# Altium project SGK_DVR_01.PrjPcb (part 1 of 2)
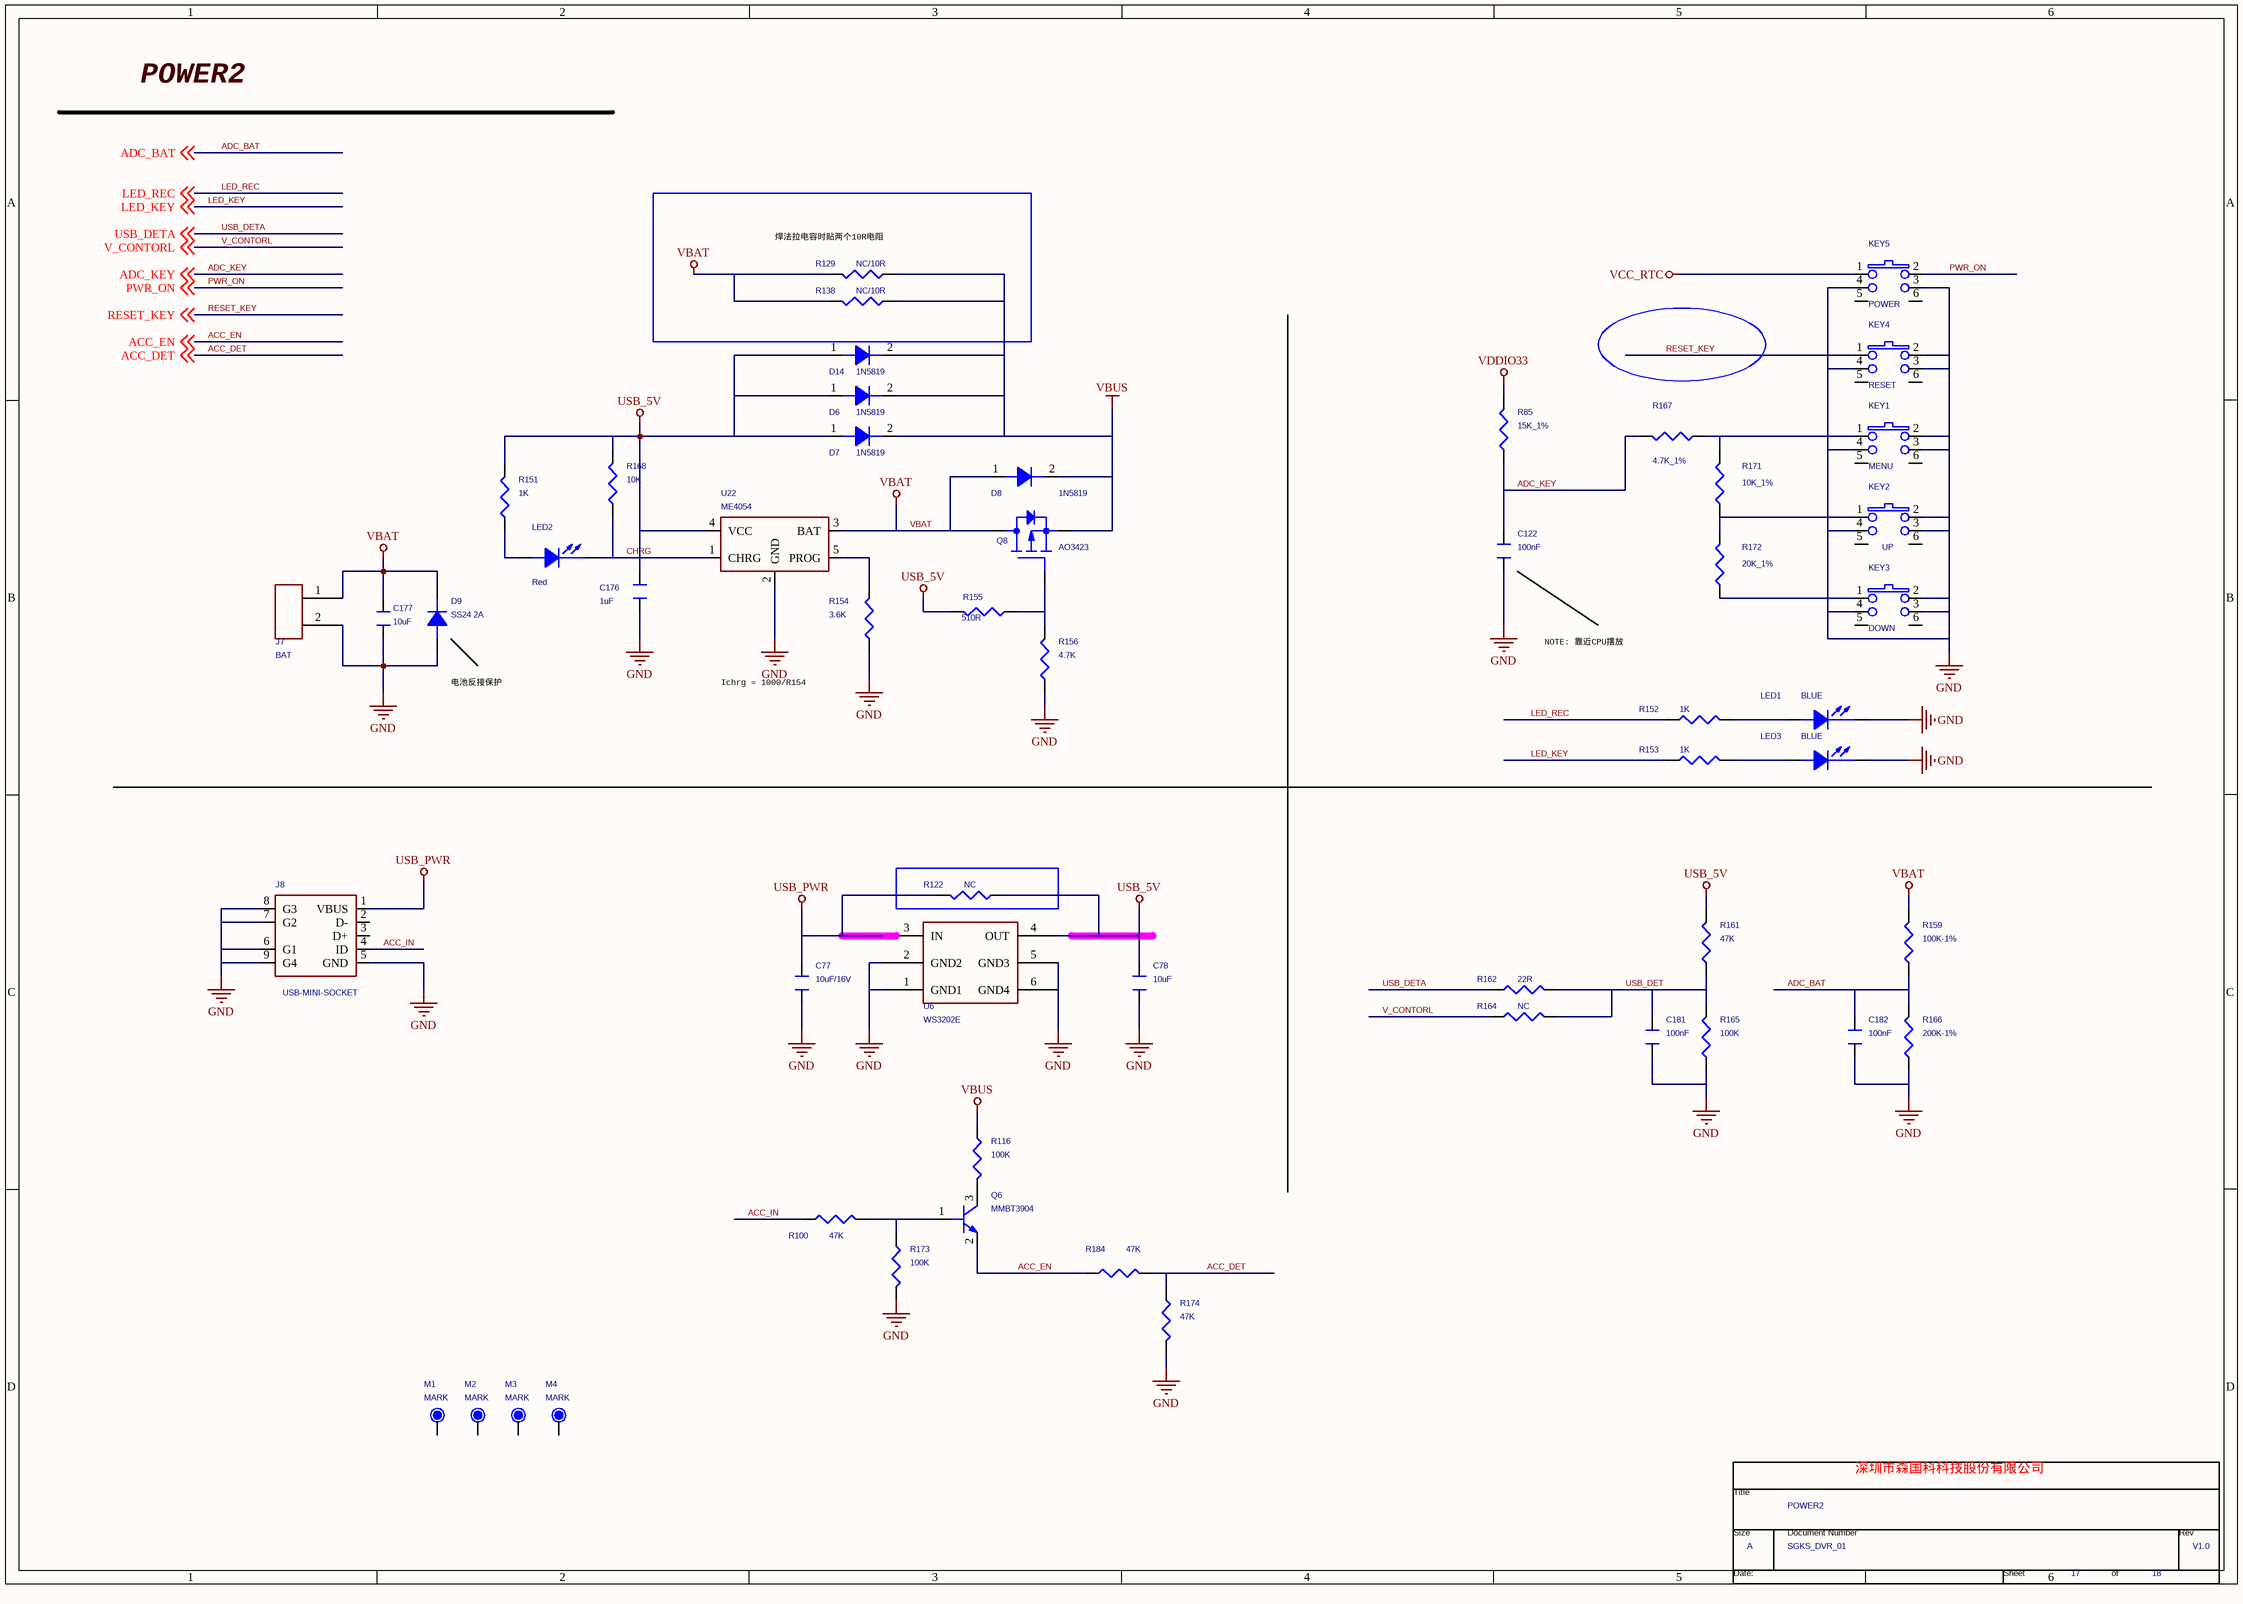
[diagram p0: P17 POWER2.SchDoc]
18 sheets, 493 parts. Net scope: global (net labels, ports and power ports of the same name join across sheets).
Board file: SGK_DVR_01.PcbDoc
Sheets:
  P17 POWER2.SchDoc
  P16 POWER1.SchDoc
  P15 AHD & USBCAM.SchDoc
  P14 FLASH & TF & GSENSO.SchDoc
  P13 MIC & AUDIO.SchDoc
  P12 MIPI LCD.SchDoc
  P11 CMOS SENSOR.SchDoc
  P10 PR2000K_MIPI.SchDoc
  P09 DDR3.SchDoc
  P08 CPU_4.SchDoc
  P07 CPU_3.SchDoc
  P06 CPU_2.SchDoc
  P05 CPU_1.SchDoc
  P04 Pin MAP.SchDoc
  P03 POWER TREE.SchDoc
  P02 Block.SchDoc
  P01 Version.SchDoc
  P18 GPS.SchDoc

## Sheet P17 POWER2.SchDoc
size 420 x 297 mm

### Parts
(Parts that share a designator on the sheet are numbered #1, #2 ... from top to bottom, then left to right.)
*#1  Page Count: 18  Page Number: 17  Page Size: A  Title: POWER2  RevCode: V1.0  Doc: SGKS_DVR_01  (hidden comment: TitleBlock0)  (graphical)
C77  10uF/16V  [C0805]
C78  10uF  [C0805]
C122  100nF  [C0402]
C176  1uF  [C0402]
C177  10uF  [C0603]
C181  100nF  [C0402]
C182  100nF  [C0402]
D6  1N5819  [SOD-123]
D7  1N5819  [SOD-123]
D8  1N5819  [SOD-123]
D9  SS24 2A  [SOD-123]
D14  1N5819  [SOD-123]
J7  BAT  [CON2P254]
J8  USB-MINI-SOCKET  [USB_MINI_AB]
KEY1  MENU  [button]
KEY2  UP  [button]
KEY3  DOWN  [button]
KEY4  RESET  [button]
KEY5  POWER  [button]
LED1  BLUE  [LED-0603]
LED2  Red  [LED-0603]
LED3  BLUE  [LED-0603]
M1  MARK  [TP/SMD/D1.0]
M2  MARK  [TP/SMD/D1.0]
M3  MARK  [TP/SMD/D1.0]
M4  MARK  [TP/SMD/D1.0]
Q6  MMBT3904  [SOT-23]
Q8  AO3423  [SOT-23]
R85  15K_1%  [R0402]
R100  47K  [R0603/SMD]
R116  100K  [R0603/SMD]
R122  NC  [R0603]
R129  NC/10R  [R0603]
R138  NC/10R  [R0603]
R151  1K  [R0402]
R152  1K  [R0603/SMD]
R153  1K  [R0603/SMD]
R154  3.6K  [R0402]
R155  510R  [R0402]
R156  4.7K  [R0402]
R159  100K-1%  [R0402]
R161  47K  [R0402]
R162  22R  [R0603/SMD]
R164  NC  [R0603/SMD]
R165  100K  [R0402]
R166  200K-1%  [R0402]
R167  4.7K_1%  [R0603/SMD]
R168  10K  [R0402]
R171  10K_1%  [R0603/SMD]
R172  20K_1%  [R0603/SMD]
R173  100K  [R0603/SMD]
R174  47K  [R0603/SMD]
R184  47K  [R0603/SMD]
U6  WS3202E  [SOT23-6]
U22  ME4054  [SOT23-6]

### Blocks framed on the sheet
焊法拉电容时贴两个10R电阻: R129 R138

### Nets
GND: C77.1 C78.1 C122.1 C176.1 C177.1 C181.1 C182.1 D9.1(A) J7.2 J8.5(GND) J8.6(G1) J8.7(G2) J8.8(G3) J8.9(G4) KEY1.2 KEY1.3 KEY1.4 KEY2.2 KEY2.3 KEY2.4 KEY3.2 KEY3.3 KEY3.4 KEY4.2 KEY4.3 KEY4.4 KEY5.3 KEY5.4 LED1.2(CATHODE) LED3.2(CATHODE) R154.1 R156.1 R165.2 R166.2 R173.2 R174.2 U6.1(GND1) U6.2(GND2) U6.5(GND3) U6.6(GND4) U22.2(GND)
USB_5V: C78.2 C176.2 D6.1(A) D7.1(A) D14.1(A) R122.1 R151.2 R155.2 R161.1 R168.2 U6.4(OUT) U22.4(VCC)
USB_PWR: C77.2 J8.1(VBUS) R122.2 U6.3(IN)
VBAT: C177.2 D8.1(A) D9.2(K) J7.1 Q8.3(DRAIN) R129.2 R138.2 R159.1 U22.3(BAT)
VBUS: D6.2(K) D7.2(K) D8.2(K) D14.2(K) Q8.2(SOURCE) R116.1 R129.1 R138.1
VCC_RTC: KEY5.1
VDDIO33: R85.1  [project net AVDD33]
ACC_DET: R174.1 R184.2 ; off-sheet ACC_DET
ACC_EN: Q6.2(E) R184.1 ; off-sheet ACC_EN
ACC_IN: J8.4(ID) R100.1
ADC_BAT: C182.2 R159.2 R166.1 ; off-sheet ADC_BAT
ADC_KEY: C122.2 R85.2 R167.2 ; off-sheet ADC_KEY
CHRG: LED2.2(CATHODE) R168.1 U22.1(CHRG)
LED_KEY: R153.1 ; off-sheet LED_KEY
LED_REC: R152.1 ; off-sheet LED_REC
PWR_ON: KEY5.2 ; off-sheet PWR_ON
RESET_KEY: KEY4.1 ; off-sheet RESET_KEY
USB_DET: C181.2 R161.2 R162.2 R164.2 R165.1
USB_DETA: R162.1 ; off-sheet USB_DETA
V_CONTORL: R164.1 ; off-sheet V_CONTORL
NetKEY1_1: KEY1.1 R167.1 R171.2
NetKEY2_1: KEY2.1 R171.1 R172.2
NetKEY3_1: KEY3.1 R172.1
NetLED1_1: LED1.1(ANODE) R152.2
NetLED2_1: LED2.1(ANODE) R151.1
NetLED3_1: LED3.1(ANODE) R153.2
NetQ6_1: Q6.1(B) R100.2 R173.1
NetQ6_3: Q6.3(C) R116.2
NetQ8_1: Q8.1(GATE) R155.1 R156.2
NetR154_2: R154.2 U22.5(PROG)

Not connected (* = marked no-connect by the designer): J8 2(D-) 3(D+); KEY1 5 6; KEY2 5 6; KEY3 5 6; KEY4 5 6; KEY5 5 6; M1 1; M2 1; M3 1; M4 1

### Notes on the sheet
- POWER2
- NOTE: 靠近CPU摆放
- (near D9) 电池反接保护
- Ichrg = 1000/R154
- 深圳市森国科科技股份有限公司
- (in symbol TitleBlock0) Title; Size; Document Number; Rev; Date:; Sheet; of

### Library data of the parts
C77 C78 = CAPACITOR_0_Dup4: ROOM: PMU; PAGE: 1
C122 = CAPACITOR_0_Dup4: PAGE: 1; ROOM: PMU
C176 C177 C181 C182 = CAPACITOR: PAGE: 1
D6-D8 D14 = DIODE_0: 二极管
D9 = DIODE
J7 = CON3_0
J8 = USB_MINI_SOCKET_2
KEY1-KEY5 = button_1: Button; FPLIST: BUTTON,KEY; Part Number: Button; Part Type: 轻触按键
LED1-LED3 = LED
M1-M4 = TP_0: Part Description: Test Point; Type: NC
Q6 = NPN
Q8 = PMOS
R85 R159 R161 R165 R166 = RESISTOR_Dup2
R100 R116 R173 R174 R184 = RES/SMD_1: Part Description: Chip Resistor; Type: 贴片电阻
R122 R129 R138 R151 R154-R156 R168 = R_Dup1
R152 R153 R162 R164 R167 R171 R172 = RES/SMD_0: Part Description: Chip Resistor
U6 = AP3031_0: Page: 10
U22 = RT9266PE_0_Dup1
*#1 = TitleBlock0: Page Create Date: March  8, 1995

## Sheet P16 POWER1.SchDoc
size 420 x 297 mm
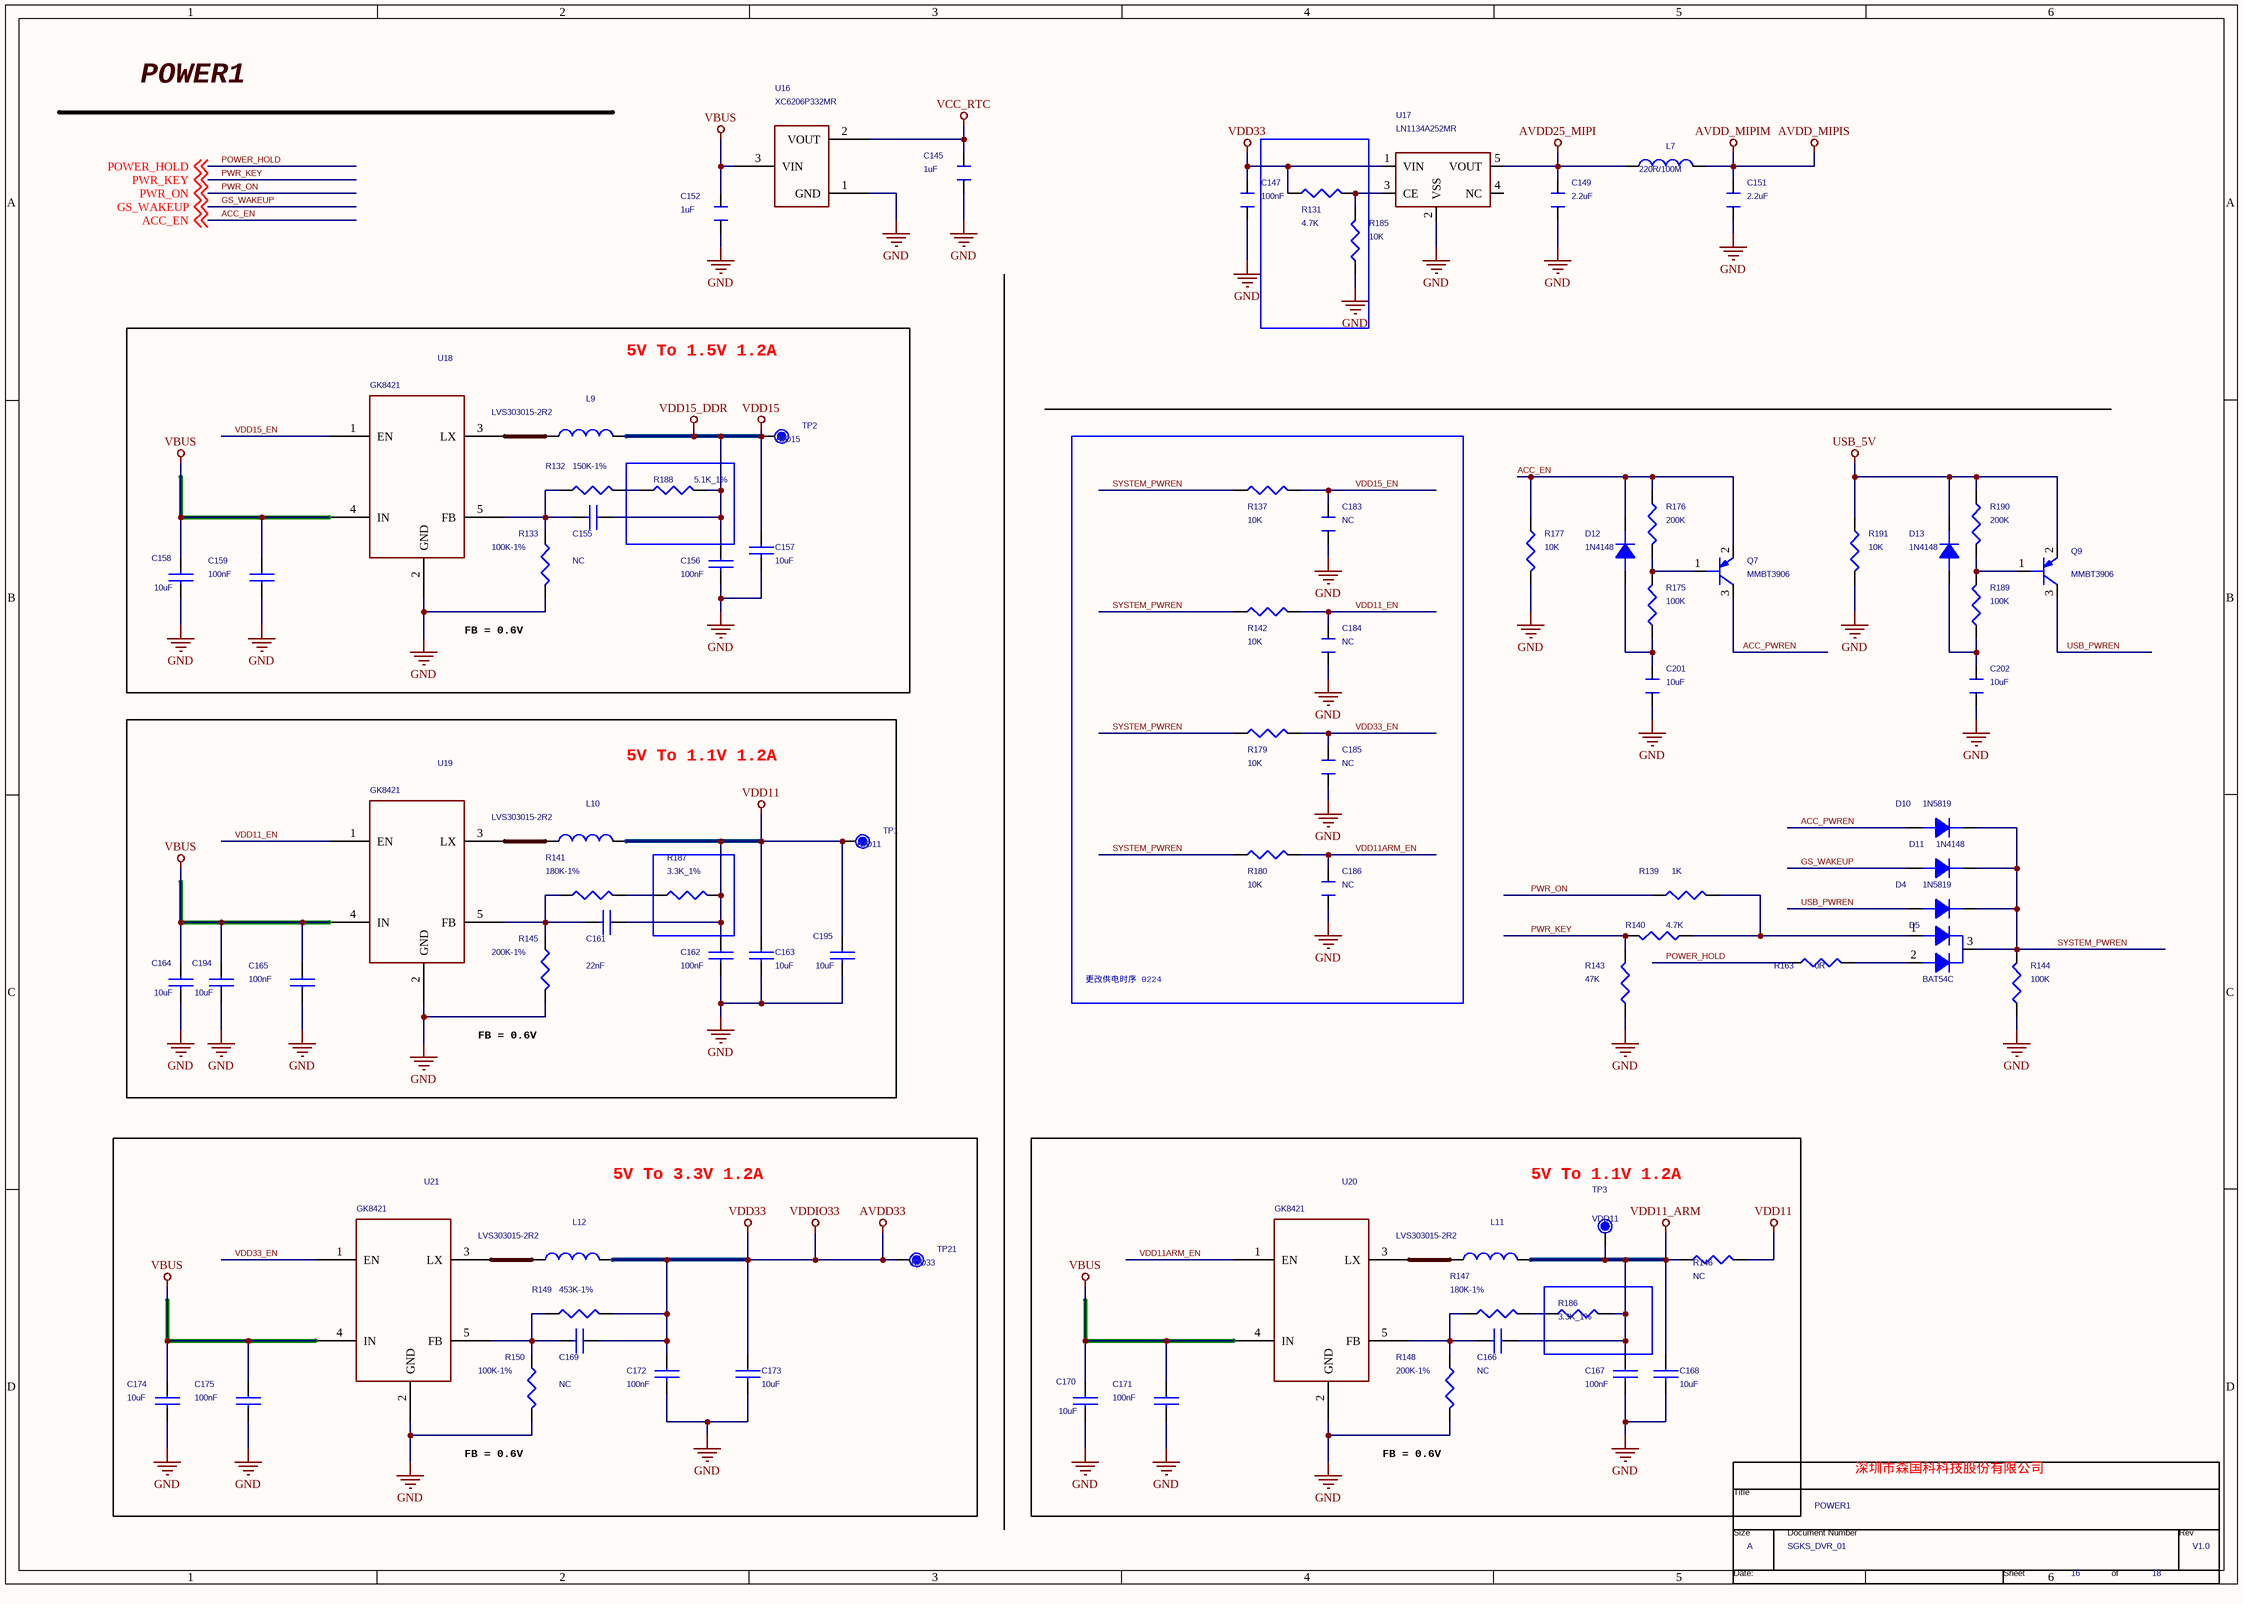
[diagram p1: P16 POWER1.SchDoc]

### Parts
(Parts that share a designator on the sheet are numbered #1, #2 ... from top to bottom, then left to right.)
*#2  Page Count: 18  Page Number: 16  Page Size: A  Title: POWER1  RevCode: V1.0  Doc: SGKS_DVR_01  (hidden comment: TitleBlock0)  (graphical)
C145  1uF  [C0402]
C147  100nF  [C0402]
C149  2.2uF  [C0402]
C151  2.2uF  [C0402]
C152  1uF  [C0402]
C155  NC  [C0402]
C156  100nF  [C0402]
C157  10uF  [C0603]
C158  10uF  [C0603]
C159  100nF  [C0402]
C161  22nF  [C0402]
C162  100nF  [C0402]
C163  10uF  [C0603]
C164  10uF  [C0603]
C165  100nF  [C0402]
C166  NC  [C0402]
C167  100nF  [C0402]
C168  10uF  [C0603]
C169  NC  [C0402]
C170  10uF  [C0603]
C171  100nF  [C0402]
C172  100nF  [C0402]
C173  10uF  [C0603]
C174  10uF  [C0603]
C175  100nF  [C0402]
C183  NC  [C0402]
C184  NC  [C0402]
C185  NC  [C0402]
C186  NC  [C0402]
C194  10uF  [C0603]
C195  10uF  [C0603]
C201  10uF  [C0603]
C202  10uF  [C0603]
D4  1N5819  [SOD-123]
D5  BAT54C  [SOT-23]
D10  1N5819  [SOD-123]
D11  1N4148  [SOD-123]
D12  1N4148  [SOD-123]
D13  1N4148  [SOD-123]
L7  220R/100M  [L0402]
L9  LVS303015-2R2  [PL4X4]
L10  LVS303015-2R2  [PL4X4]
L11  LVS303015-2R2  [PL4X4]
L12  LVS303015-2R2  [PL4X4]
Q7  MMBT3906  [SOT-23]
Q9  MMBT3906  [SOT-23]
R131  4.7K  [R0603/SMD]
R132  150K-1%  [R0402]
R133  100K-1%  [R0402]
R137  10K  [R0402]
R139  1K  [R0402]
R140  4.7K  [R0402]
R141  180K-1%  [R0402]
R142  10K  [R0402]
R143  47K  [R0402]
R144  100K  [R0402]
R145  200K-1%  [R0402]
R146  NC  [R0603]
R147  180K-1%  [R0402]
R148  200K-1%  [R0402]
R149  453K-1%  [R0402]
R150  100K-1%  [R0402]
R163  0R  [R0402]
R175  100K  [R0402]
R176  200K  [R0402]
R177  10K  [R0402]
R179  10K  [R0402]
R180  10K  [R0402]
R185  10K  [R0603/SMD]
R186  3.3K_1%  [R0402]
R187  3.3K_1%  [R0402]
R188  5.1K_1%  [R0402]
R189  100K  [R0402]
R190  200K  [R0402]
R191  10K  [R0402]
TP1  VDD11  [TP/SMD/D1.0]
TP2  VDD15  [TP/SMD/D1.0]
TP3  VDD11  [TP/SMD/D1.0]
TP21  VDD33  [TP/SMD/D1.0]
U16  XC6206P332MR  [SOT-23]
U17  LN1134A252MR  [SOT23-6]
U18  GK8421  [SOT23-5]
U19  GK8421  [SOT23-5]
U20  GK8421  [SOT23-5]
U21  GK8421  [SOT23-5]

### Blocks framed on the sheet
5V To 1.5V 1.2A: C155-C159 L9 R132 R133 R188 TP2 U18
更改供电时序 0224: C183-C186 R137 R142 R179 R180
5V To 1.1V 1.2A: C161-C165 C194 C195 L10 R141 R145 R187 TP1 U19
5V To 3.3V 1.2A: C169 C172-C175 L12 R149 R150 TP21 U21
5V To 1.1V 1.2A: *#2 C166-C168 C170 C171 L11 R146-R148 R186 TP3 U20

### Nets
AVDD25_MIPI: C149.2 L7.2 U17.5(VOUT)
AVDD33: C147.2 C169.1 C172.1 C173.1 L12.2 R131.1 R149.1 TP21.1 U17.1(VIN)  [also labelled VDD33, VDDIO33]
AVDD_MIPIM: C151.2 L7.1  [also labelled AVDD_MIPIS]
GND: C145.1 C147.1 C149.1 C151.1 C152.1 C156.2 C157.2 C158.2 C159.2 C162.2 C163.2 C164.2 C165.2 C167.2 C168.2 C170.2 C171.2 C172.2 C173.2 C174.2 C175.2 C183.1 C184.1 C185.1 C186.1 C194.2 C195.2 C201.1 C202.1 R133.2 R143.2 R144.2 R145.2 R148.2 R150.2 R177.2 R185.1 R191.2 U16.1(GND) U17.2(VSS) U18.2(GND) U19.2(GND) U20.2(GND) U21.2(GND)
USB_5V: D13.2(K) Q9.2(E) R190.1 R191.1
VBUS: C152.2 C158.1 C159.1 C164.1 C165.1 C170.1 C171.1 C174.1 C175.1 C194.1 U16.3(VIN) U18.4(IN) U19.4(IN) U20.4(IN) U21.4(IN)
VCC_RTC: C145.2 U16.2(VOUT)
VDD11: C161.1 C162.1 C163.1 C195.1 L10.2 R146.2 R187.1 TP1.1
VDD11_ARM: C166.1 C167.1 C168.1 L11.2 R146.1 R186.1 TP3.1  [project net DVDD_DDR]
VDD15: C155.1 C156.1 C157.1 L9.2 R188.1 TP2.1  [also labelled VDD15_DDR]
ACC_EN: D12.2(K) Q7.2(E) R176.1 R177.1 ; off-sheet ACC_EN
ACC_PWREN: D10.1(A) Q7.3(C)
GS_WAKEUP: D11.1(A) ; off-sheet GS_WAKEUP
POWER_HOLD: R163.2 ; off-sheet POWER_HOLD
PWR_KEY: R140.1 R143.1 ; off-sheet PWR_KEY
PWR_ON: R139.2 ; off-sheet PWR_ON
SYSTEM_PWREN: D4.2(K) D5.3(K) D10.2(K) D11.2(K) R137.1 R142.1 R144.1 R179.1 R180.1
USB_PWREN: D4.1(A) Q9.3(C)
VDD11_EN: C184.2 R142.2 U19.1(EN)
VDD11ARM_EN: C186.2 R180.2 U20.1(EN)
VDD15_EN: C183.2 R137.2 U18.1(EN)
VDD33_EN: C185.2 R179.2 U21.1(EN)
NetC155_2: C155.2 R132.2 R133.1 U18.5(FB)
NetC161_2: C161.2 R141.2 R145.1 U19.5(FB)
NetC166_2: C166.2 R147.2 R148.1 U20.5(FB)
NetC169_2: C169.2 R149.2 R150.1 U21.5(FB)
NetC201_2: C201.2 D12.1(A) R175.1
NetC202_2: C202.2 D13.1(A) R189.1
NetD5_1: D5.1(A1) R139.1 R140.2
NetD5_2: D5.2(A2) R163.1
NetL9_1: L9.1 U18.3(LX)
NetL10_1: L10.1 U19.3(LX)
NetL11_1: L11.1 U20.3(LX)
NetL12_1: L12.1 U21.3(LX)
NetQ7_1: Q7.1(B) R175.2 R176.2
NetQ9_1: Q9.1(B) R189.2 R190.2
NetR131_2: R131.2 R185.2 U17.3(CE)
NetR132_1: R132.1 R188.2
NetR141_1: R141.1 R187.2
NetR147_1: R147.1 R186.2

Not connected (* = marked no-connect by the designer): U17 4(NC)

### Notes on the sheet
- POWER1
- FB = 0.6V
- 深圳市森国科科技股份有限公司
- (in symbol TitleBlock0) Title; Size; Document Number; Rev; Date:; Sheet; of

### Library data of the parts
C145 C147 C149 C151 C152 C201 C202 = CAPACITOR: PAGE: 1
C155-C159 C161-C175 C194 C195 = CAP
C183-C186 = CAPACITOR: Page: 10
D4 D10-D13 = DIODE
D5 = DIODE_1: 二极管
L7 = INDUCTOR_2
L9-L12 = INDUCTOR_Dup1
Q7 Q9 = PNP CEB
R131 R185 = RES/SMD_1: Part Description: Chip Resistor; Type: 贴片电阻
R132 R133 R141 R145-R150 R186-R188 = RESISTOR_Dup2
R137 R140 R142-R144 R177 R179 R180 R191 = R_Dup1
R139 R163 R175 R176 R189 R190 = R
TP1-TP3 TP21 = TP_0: Part Description: Test Point; Type: NC
U16 = RT9166
U17 = RT9266PE_0
U18-U21 = MP2161_2
*#2 = TitleBlock0: Page Create Date: March  8, 1995

## Sheet P15 AHD & USBCAM.SchDoc
size 420 x 297 mm
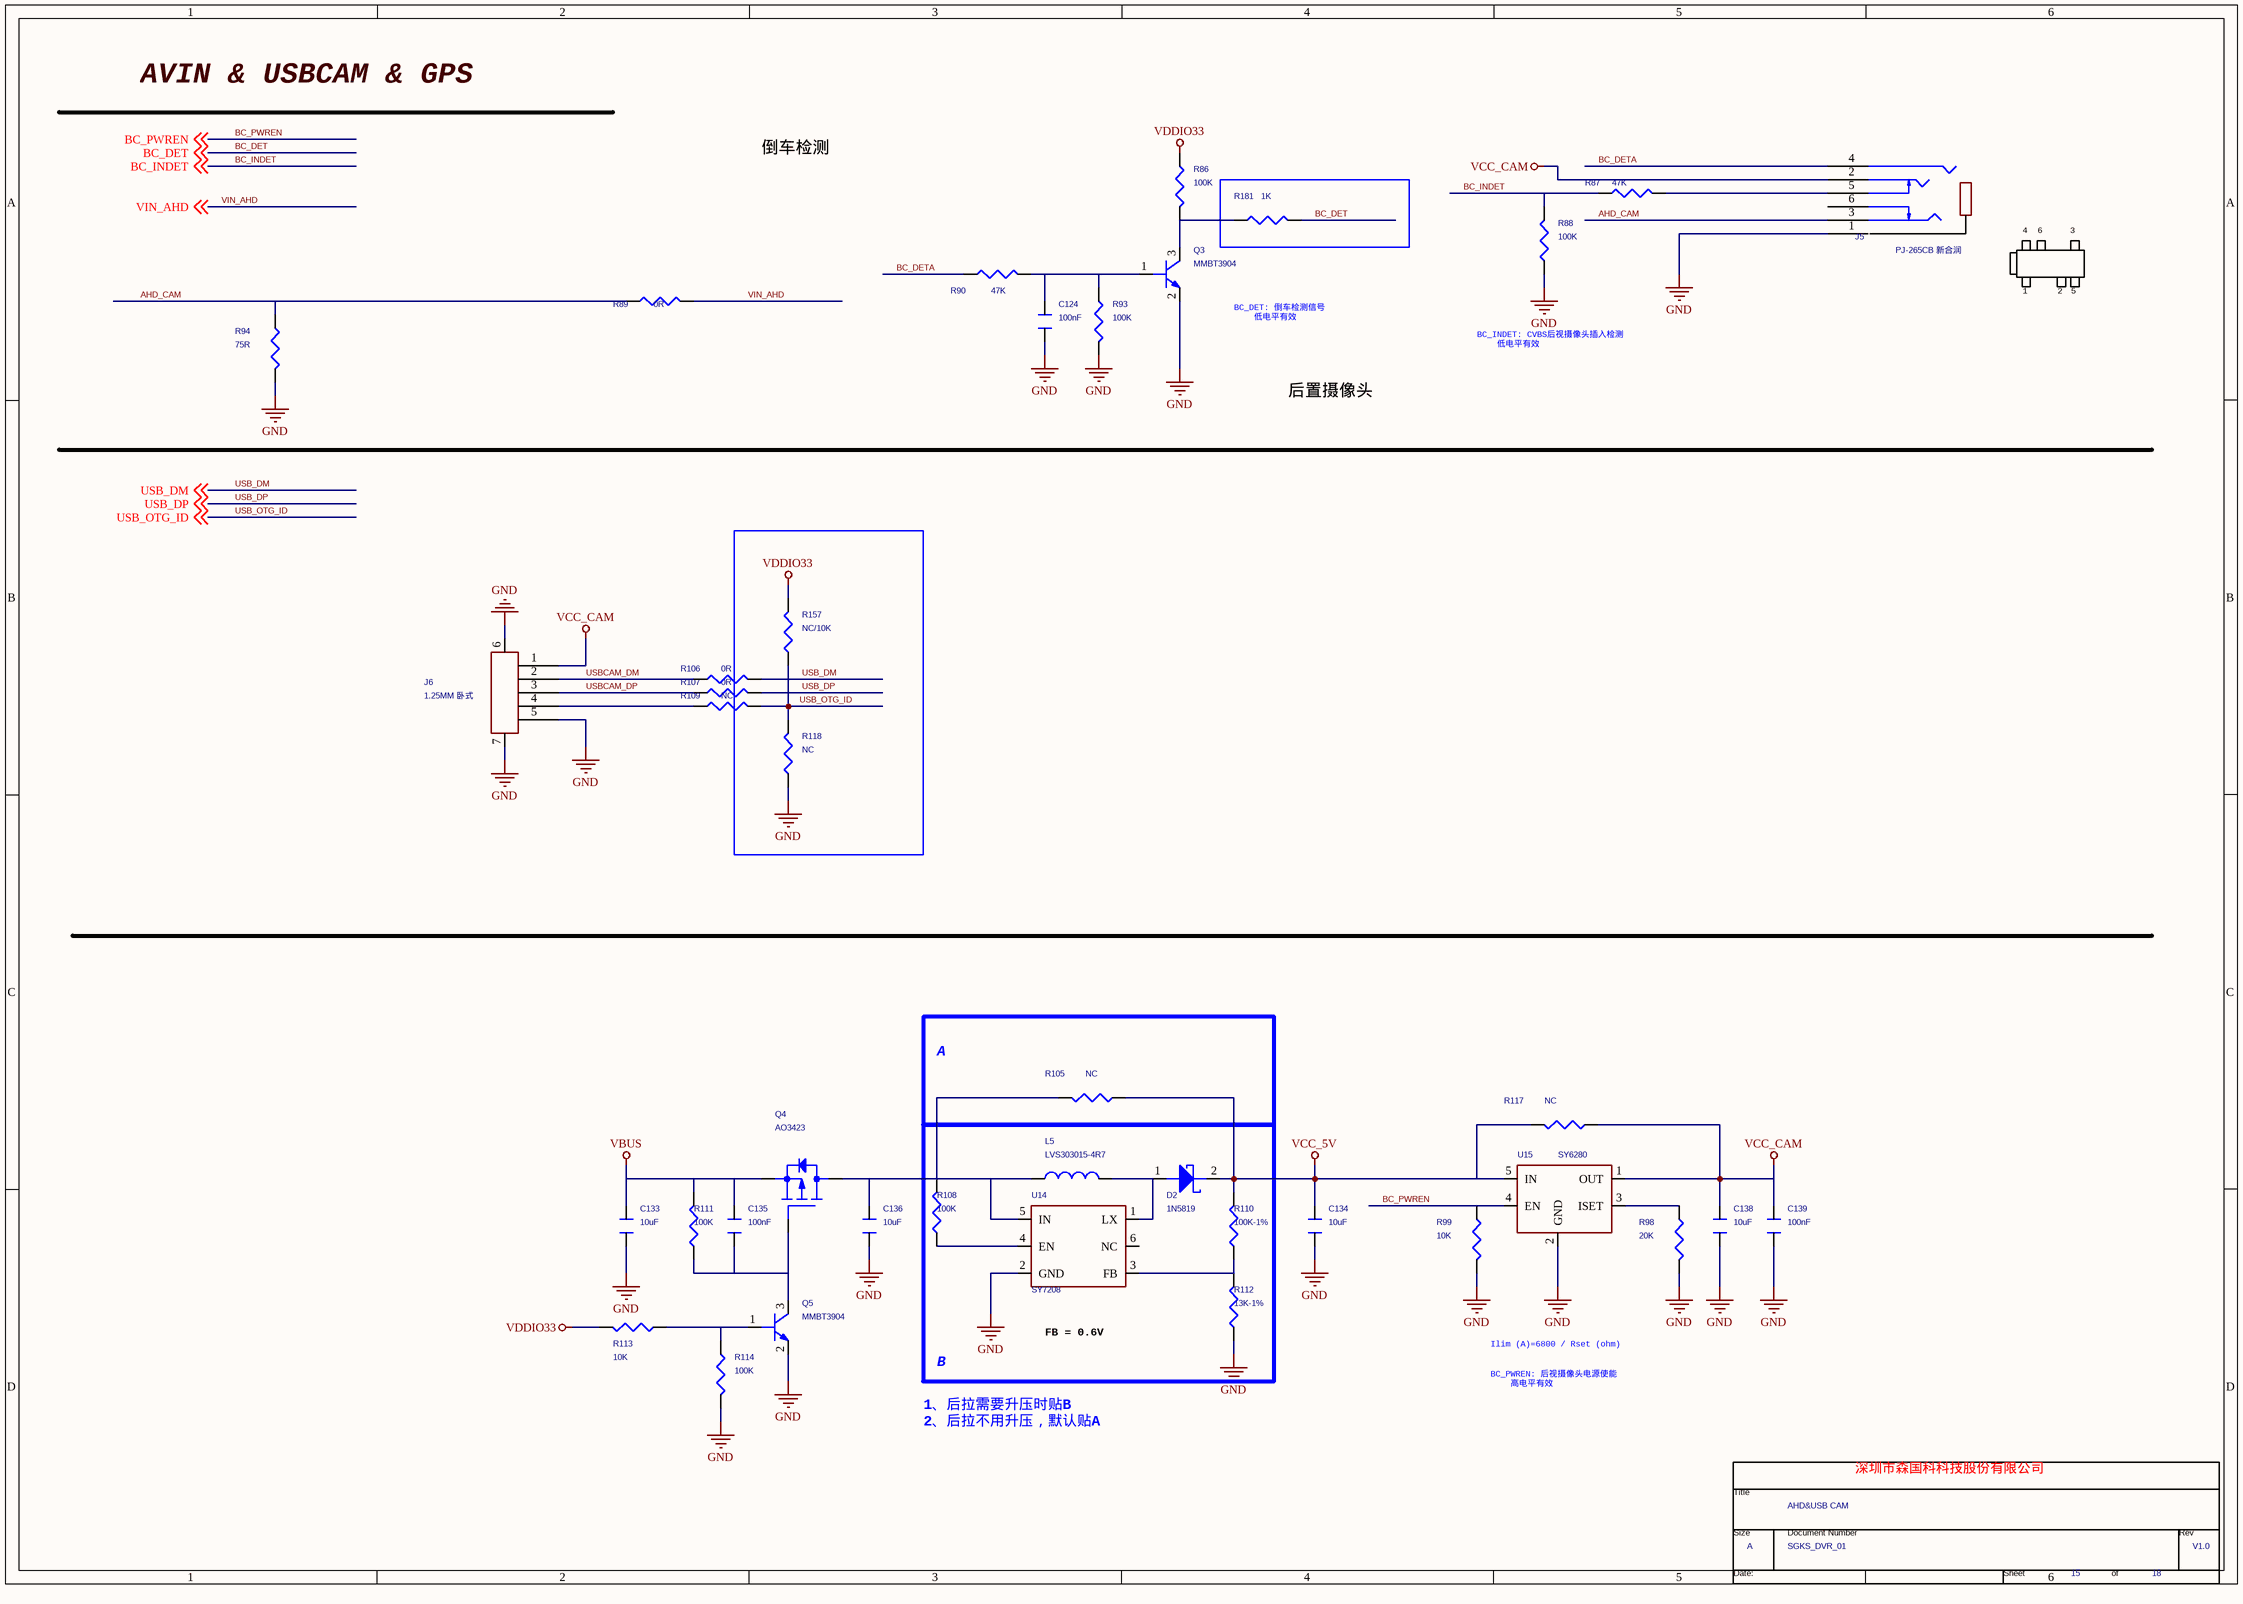
[diagram p2: P15 AHD & USBCAM.SchDoc]

### Parts
(Parts that share a designator on the sheet are numbered #1, #2 ... from top to bottom, then left to right.)
*#3  Page Count: 18  Page Number: 15  Page Size: A  Title: AHD&USB CAM  RevCode: V1.0  Doc: SGKS_DVR_01  (hidden comment: TitleBlock0)  (graphical)
C124  100nF  [C0402]
C133  10uF  [C0603]
C134  10uF  [C0603]
C135  100nF  [C0402]
C136  10uF  [C0603]
C138  10uF  [C0603]
C139  100nF  [C0402]
D2  1N5819  [SOD123]
J5  PJ-265CB 新合润  [TSH-3865D]
J6  1.25MM 卧式  [CON_5P_1.25]
L5  LVS303015-4R7  [PL4X4]
Q3  MMBT3904  [SOT-23]
Q4  AO3423  [SOT-23]
Q5  MMBT3904  [SOT-23]
R86  100K  [R0603/SMD]
R87  47K  [R0603/SMD]
R88  100K  [R0603/SMD]
R89  0R  [R0402]
R90  47K  [R0603/SMD]
R93  100K  [R0603/SMD]
R94  75R  [R0402]
R98  20K  [R0402]
R99  10K  [R0402]
R105  NC  [R0603/SMD]
R106  0R  [R0603/SMD]
R107  0R  [R0603/SMD]
R108  100K  [R0603/SMD]
R109  NC  [R0603/SMD]
R110  100K-1%  [R0603/SMD]
R111  100K  [R0603/SMD]
R112  13K-1%  [R0603/SMD]
R113  10K  [R0603/SMD]
R114  100K  [R0603/SMD]
R117  NC  [R0603/SMD]
R118  NC  [R0603/SMD]
R157  NC/10K  [R0603/SMD]
R181  1K  [R0603/SMD]
U14  SY7208  [SOT23-6]
U15  SY6280  [SOT23-6]

### Blocks framed on the sheet
A: R105
B: D2 L5 R108 R110 R112 U14

### Nets
GND: C124.1 C133.1 C134.1 C136.1 C138.1 C139.1 J5.1 J6.5 J6.6 J6.7 Q3.2(E) Q5.2(E) R88.1 R93.2 R94.2 R98.2 R99.2 R112.1 R114.2 R118.1 U14.2(GND) U15.2(GND)
VBUS: C133.2 C135.2 Q4.2(SOURCE) R111.2
VCC_5V: C134.2 D2.2 R105.1 R110.2 R117.2 U15.5(IN)
VCC_CAM: C138.2 C139.2 J5.2 J6.1 R117.1 U15.1(OUT)
VDDIO33: R86.1 R113.2 R157.2  [project net AVDD33]
AHD_CAM: J5.3 R89.1 R94.1
BC_DET: R181.2 ; off-sheet BC_DET
BC_DETA: J5.4 R90.1
BC_INDET: R87.1 R88.2 ; off-sheet BC_INDET
BC_PWREN: R99.1 U15.4(EN) ; off-sheet BC_PWREN
USB_DM: R106.2 ; off-sheet USB_DM
USB_DP: R107.2 ; off-sheet USB_DP
USB_OTG_ID: R109.2 R118.2 R157.1 ; off-sheet USB_OTG_ID
USBCAM_DM: J6.2 R106.1
USBCAM_DP: J6.3 R107.1
VIN_AHD: R89.2 ; off-sheet VIN_AHD
NetC124_2: C124.2 Q3.1(B) R90.2 R93.1
NetC135_1: C135.1 Q4.1(GATE) Q5.3(C) R111.1
NetC136_2: C136.2 L5.1 Q4.3(DRAIN) R105.2 R108.2 U14.5(IN)
NetD2_1: D2.1 L5.2 U14.1(LX)
NetJ5_5: J5.5 R87.2
NetJ6_4: J6.4 R109.1
NetQ3_3: Q3.3(C) R86.2 R181.1
NetQ5_1: Q5.1(B) R113.1 R114.1
NetR98_1: R98.1 U15.3(ISET)
NetR108_1: R108.1 U14.4(EN)
NetR110_1: R110.1 R112.2 U14.3(FB)

Not connected (* = marked no-connect by the designer): J5 6; U14 6(NC)

### Notes on the sheet
- AVIN & USBCAM & GPS
- 倒车检测
- 4
- 6
- 3
- BC_DET: 倒车检测信号
  低电平有效
- BC_INDET: CVBS后视摄像头插入检测
  低电平有效
- 1
- 2
- 5
- 后置摄像头
- FB = 0.6V
- 1、后拉需要升压时贴B
  2、后拉不用升压，默认贴A
- BC_PWREN: 后视摄像头电源使能
  高电平有效
- Ilim (A)=6800 / Rset (ohm)
- 深圳市森国科科技股份有限公司
- (in symbol TitleBlock0) Title; Size; Document Number; Rev; Date:; Sheet; of

### Library data of the parts
C124 C133 C135 C136 C138 C139 = CAPACITOR: PAGE: 1
C134 = CAPACITOR_0: PAGE: 1
D2 = DIODE_SCHOTTKY_0
J5 = PHONOJACK_0
J6 = CON3_2
L5 = INDUCTOR_Dup1
Q3 Q5 = NPN
Q4 = PMOS
R86-R88 R90 R93 R105-R114 R117 R118 R157 R181 = RES/SMD_1: Part Description: Chip Resistor; Type: 贴片电阻
R89 R94 R98 R99 = RESISTOR: ROOM: TVLCD
U14 = RT9266PE_3
U15 = RT9266PE_1: Page: 9
*#3 = TitleBlock0: Page Create Date: March  8, 1995

## Sheet P14 FLASH & TF & GSENSO.SchDoc
size 420 x 297 mm
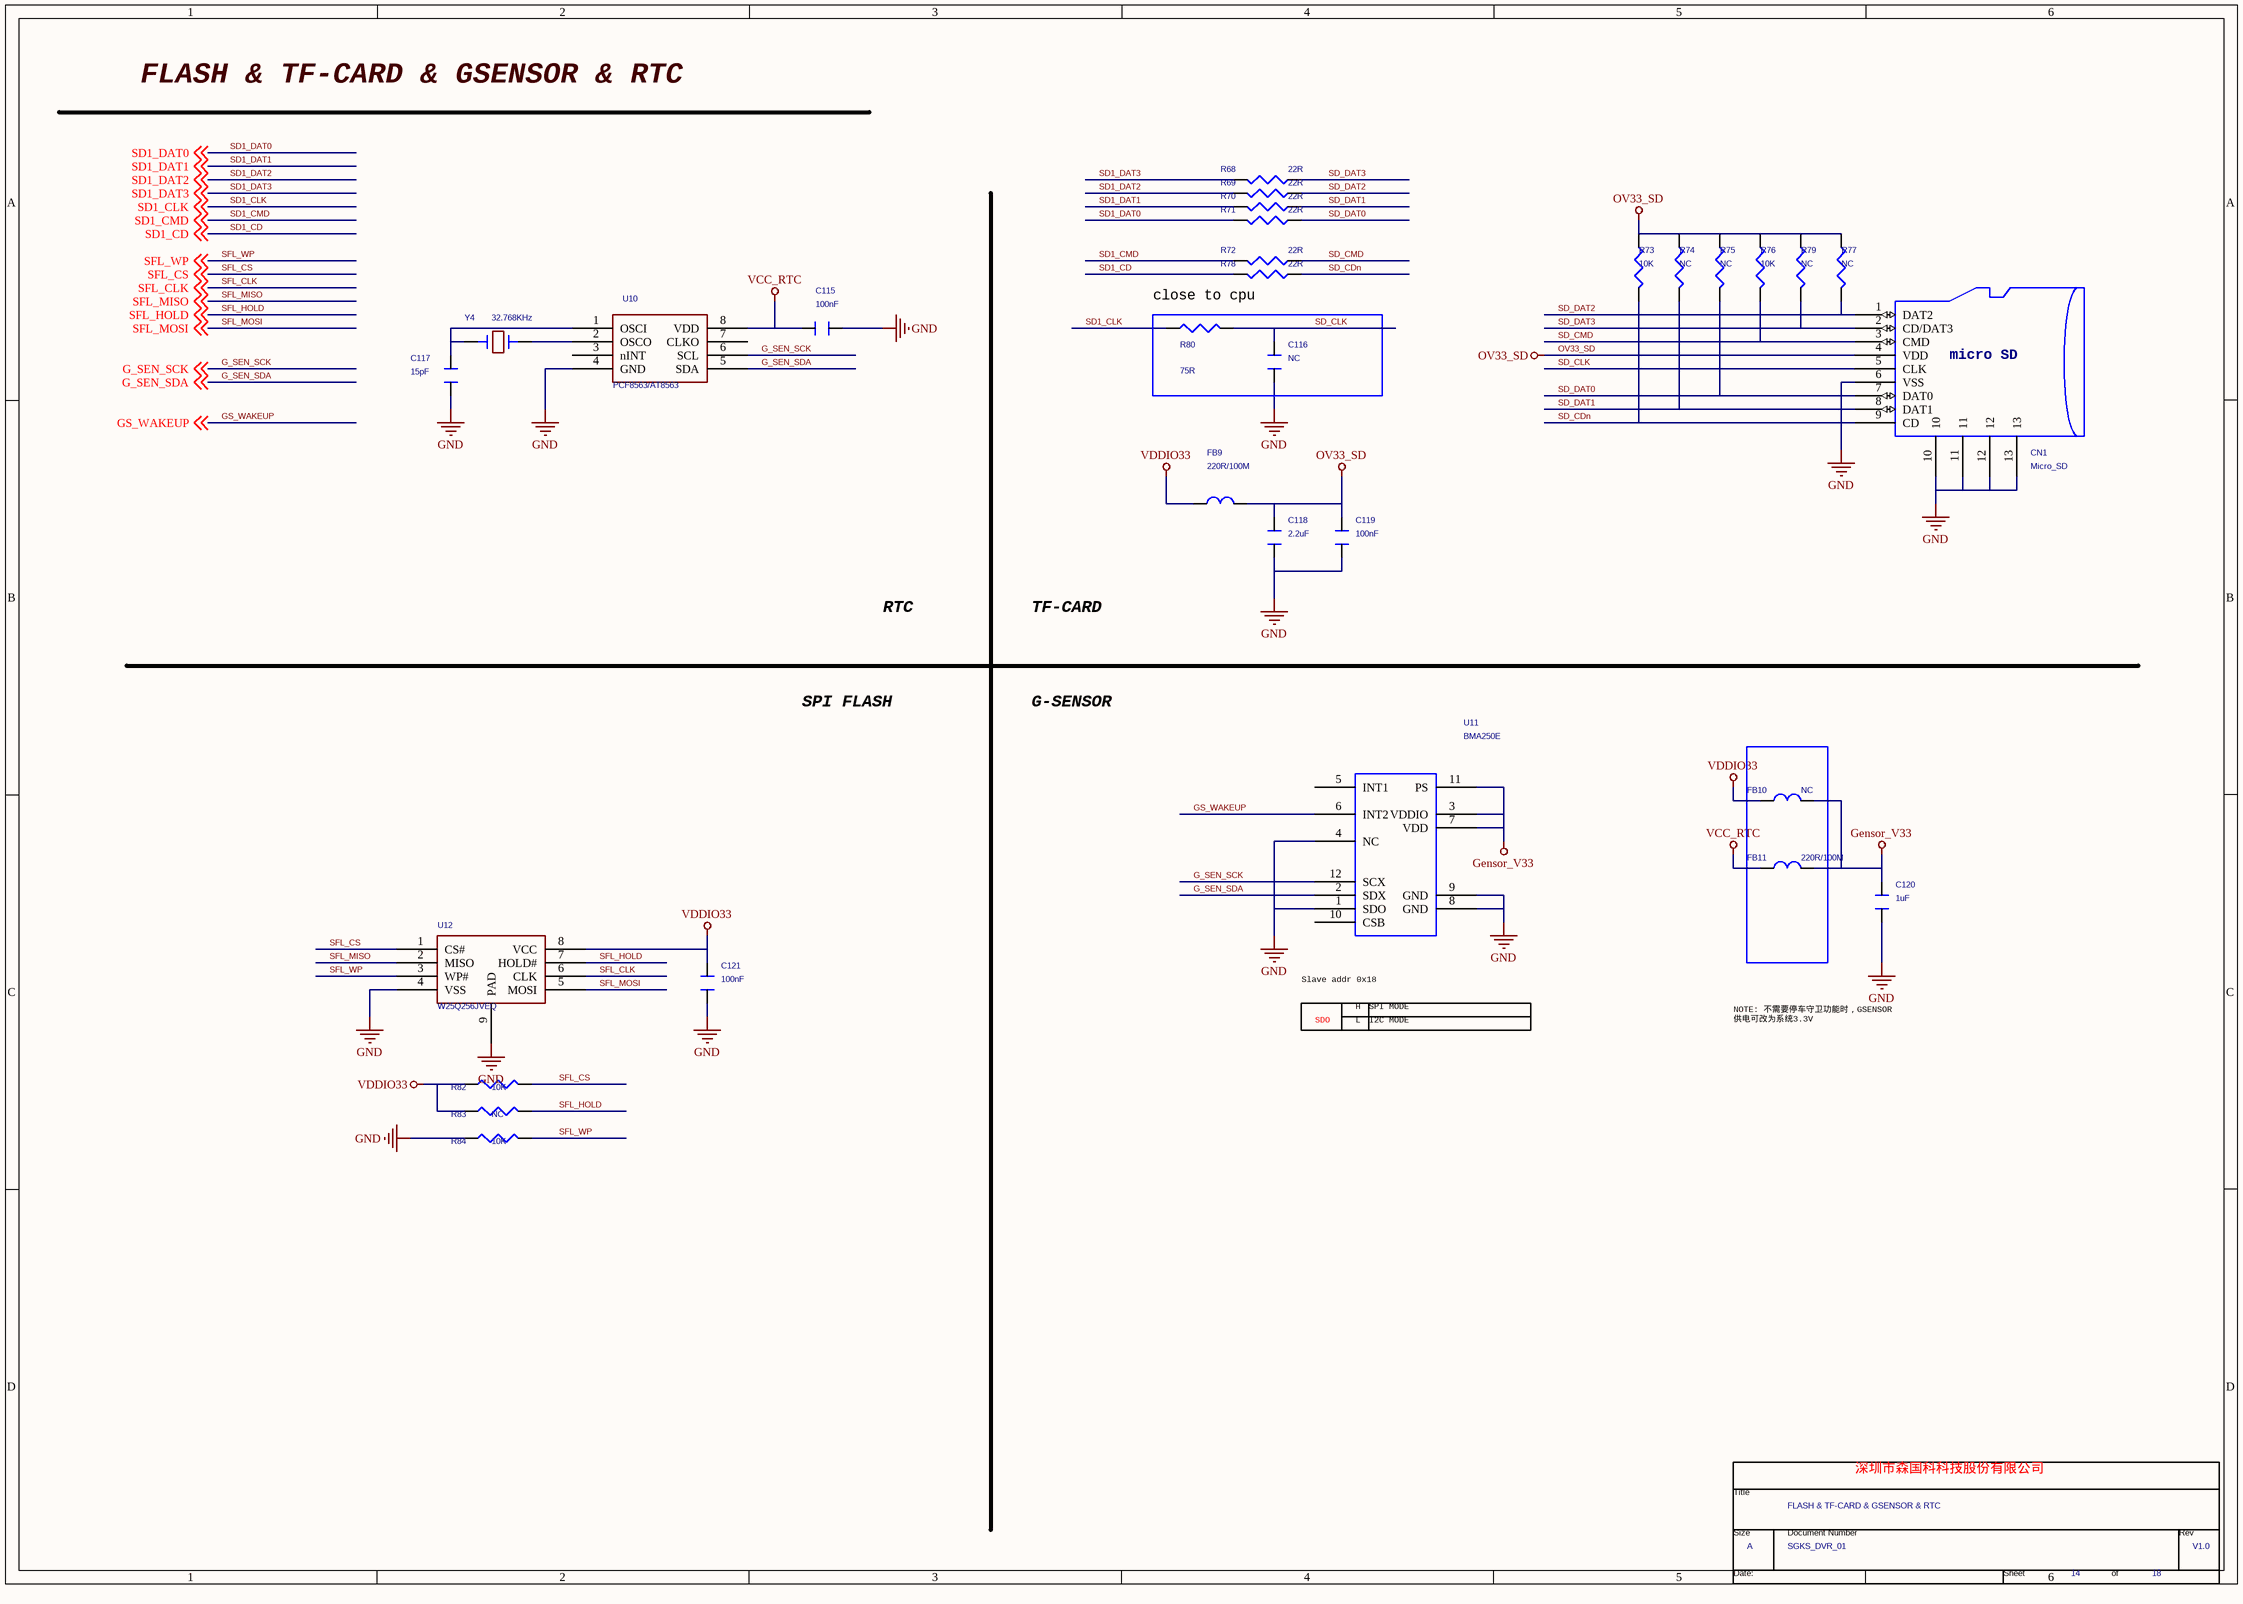
[diagram p3: P14 FLASH & TF & GSENSO.SchDoc]

### Parts
(Parts that share a designator on the sheet are numbered #1, #2 ... from top to bottom, then left to right.)
*#4  Page Count: 18  Page Number: 14  Page Size: A  Title: FLASH & TF-CARD & GSENSOR & RTC  RevCode: V1.0  Doc: SGKS_DVR_01  (hidden comment: TitleBlock0)  (graphical)
C115  100nF  [C0402]
C116  NC  [C0402]
C117  15pF  [C0402]
C118  2.2uF  [C0402]
C119  100nF  [C0402]
C120  1uF  [C0402]
C121  100nF  [C0402]
CN1  Micro_SD  [MicroSD]
FB9  220R/100M  [0805]
FB10  NC  [0805]
FB11  220R/100M  [0805]
R68  22R  [R0603/SMD]
R69  22R  [R0603/SMD]
R70  22R  [R0603/SMD]
R71  22R  [R0603/SMD]
R72  22R  [R0603/SMD]
R73  10K  [R0603/SMD]
R74  NC  [R0603/SMD]
R75  NC  [R0603/SMD]
R76  10K  [R0603/SMD]
R77  NC  [R0603/SMD]
R78  22R  [R0603/SMD]
R79  NC  [R0603/SMD]
R80  75R  [R0603/SMD]
R82  10K  [R0402]
R83  NC  [R0402]
R84  10K  [R0402]
U10  PCF8563/AT8563  [SO-8]
U11  BMA250E  [LGA12/1.8X1.8]
U12  W25Q256JVEQ  [SOIC-8]
Y4  32.768KHz  [SMD/CRY]

### Blocks framed on the sheet
close to cpu: C116 R80

### Nets
Gensor_V33: C120.1 FB10.2 FB11.2 U11.3(VDDIO) U11.7(VDD) U11.11(PS)
GND: C115.2 C116.1 C117.2 C118.1 C119.1 C120.2 C121.2 CN1.6(VSS) CN1.10 CN1.11 CN1.12 CN1.13 R84.1 U10.4(GND) U11.1(SDO) U11.4(NC) U11.8(GND) U11.9(GND) U12.4(VSS) U12.9(PAD)
OV33_SD: C118.2 C119.2 CN1.4(VDD) FB9.2 R73.1 R74.1 R75.1 R76.1 R77.1 R79.1
VCC_RTC: C115.1 FB11.1 U10.8(VDD)
VDDIO33: C121.1 FB9.1 FB10.1 R82.1 R83.1 U12.8(VCC)  [project net AVDD33]
G_SEN_SCK: U10.6(SCL) U11.12(SCX) ; off-sheet G_SEN_SCK
G_SEN_SDA: U10.5(SDA) U11.2(SDX) ; off-sheet G_SEN_SDA
GS_WAKEUP: U11.6(INT2) ; off-sheet GS_WAKEUP
SD1_CD: R78.2 ; off-sheet SD1_CD
SD1_CLK: R80.2 ; off-sheet SD1_CLK
SD1_CMD: R72.2 ; off-sheet SD1_CMD
SD1_DAT0: R71.2 ; off-sheet SD1_DAT0
SD1_DAT1: R70.2 ; off-sheet SD1_DAT1
SD1_DAT2: R69.2 ; off-sheet SD1_DAT2
SD1_DAT3: R68.2 ; off-sheet SD1_DAT3
SD_CDn: CN1.9(CD) R73.2 R78.1
SD_CLK: C116.2 CN1.5(CLK) R80.1
SD_CMD: CN1.3(CMD) R72.1 R76.2
SD_DAT0: CN1.7(DAT0) R71.1 R75.2
SD_DAT1: CN1.8(DAT1) R70.1 R74.2
SD_DAT2: CN1.1(DAT2) R69.1 R77.2
SD_DAT3: CN1.2(CD/DAT3) R68.1 R79.2
SFL_CLK: U12.6(CLK) ; off-sheet SFL_CLK
SFL_CS: R82.2 U12.1(CS#) ; off-sheet SFL_CS
SFL_HOLD: R83.2 U12.7(HOLD#) ; off-sheet SFL_HOLD
SFL_MISO: U12.2(MISO) ; off-sheet SFL_MISO
SFL_MOSI: U12.5(MOSI) ; off-sheet SFL_MOSI
SFL_WP: R84.2 U12.3(WP#) ; off-sheet SFL_WP
NetC117_1: C117.1 U10.1(OSCI) Y4.2
NetU10_2: U10.2(OSCO) Y4.1

Not connected (* = marked no-connect by the designer): U10 3(nINT) 7(CLKO); U11 5(INT1) 10(CSB)

### Notes on the sheet
- FLASH & TF-CARD & GSENSOR & RTC
- RTC
- TF-CARD
- SPI FLASH
- G-SENSOR
- Slave addr 0x18
- NOTE: 不需要停车守卫功能时，GSENSOR
  供电可改为系统3.3V
- SDO
- H
- L
- SPI MODE
- I2C MODE
- 深圳市森国科科技股份有限公司
- (in symbol SD/MICRO) micro SD
- (in symbol TitleBlock0) Title; Size; Document Number; Rev; Date:; Sheet; of

### Library data of the parts
C115 C117 = CAPACITOR: PAGE: 1
C116 C118-C121 = CAPACITOR_0_Dup3
CN1 = SD/MICRO: Type: 贴片插座
FB9-FB11 = Ferrite BEAD
R68-R80 = RES/SMD_0: Part Description: Chip Resistor
R82 = ?_0: 备注: YCL0465; 元件编号: 电阻; 元件类别: 电阻100K,±5%,1/16W,0402 每盘10K; 规格型号: 原材料; Vendor: R0402
R83 R84 = ?_0: 规格型号: 原材料; 元件类别: 电阻100K,±5%,1/16W,0402 每盘10K; 元件编号: 电阻; 备注: YCL0465; Vendor: R0402
U10 = PCF8563
U11 = GSENSOR/BMA250E_1: Part Description: IC; Type: IC
U12 = SPI-NOR-SO8_0
Y4 = CRYSTAL_2: Type: 贴片晶振
*#4 = TitleBlock0: Page Create Date: March  8, 1995

## Sheet P13 MIC & AUDIO.SchDoc
size 297 x 209 mm
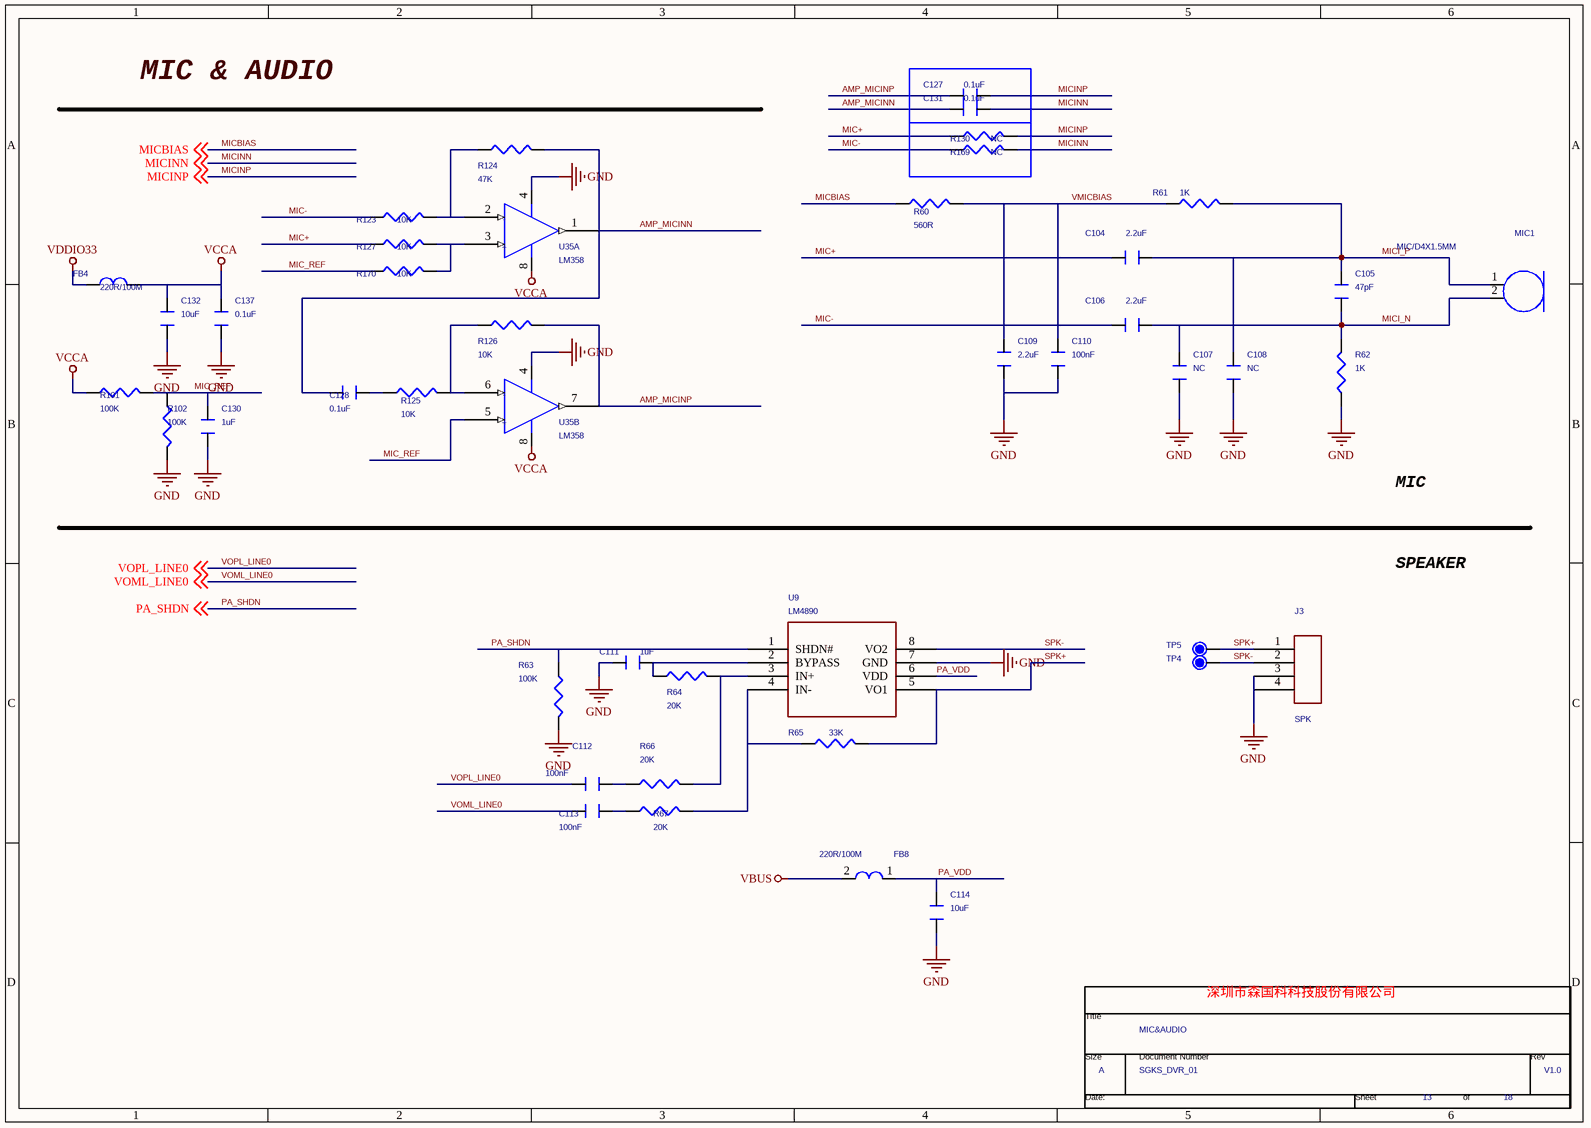
[diagram p4: P13 MIC & AUDIO.SchDoc]

### Parts
(Parts that share a designator on the sheet are numbered #1, #2 ... from top to bottom, then left to right.)
*#5  Page Count: 18  Page Number: 13  Page Size: A  Title: MIC&AUDIO  RevCode: V1.0  Doc: SGKS_DVR_01  (hidden comment: TitleBlock0)  (graphical)
C104  2.2uF  [C0402]
C105  47pF  [C0402]
C106  2.2uF  [C0402]
C107  NC  [C0402]
C108  NC  [C0402]
C109  2.2uF  [C0402]
C110  100nF  [C0402]
C111  1uF  [C0402]
C112  100nF  [C0402]
C113  100nF  [C0402]
C114  10uF  [C0603]
C127  0.1uF  [C0402]
C128  0.1uF  [C0402]
C130  1uF  [C0402]
C131  0.1uF  [C0402]
C132  10uF  [C0603]
C137  0.1uF  [C0402]
FB4  220R/100M  [0805]
FB8  220R/100M  [L0603]
J3  SPK  [SM_125X2_180]
MIC1  MIC/D4X1.5MM  [MIC-2DP]
R60  560R  [R0402]
R61  1K  [R0402]
R62  1K  [R0402]
R63  100K  [R0402]
R64  20K  [R0402]
R65  33K  [R0402]
R66  20K  [R0402]
R67  20K  [R0402]
R101  100K  [R0402]
R102  100K  [R0402]
R123  10K  [R0402]
R124  47K  [R0402]
R125  10K  [R0402]
R126  10K  [R0402]
R127  10K  [R0402]
R130  NC  [R0402]
R169  NC  [R0402]
R170  10K  [R0402]
TP4  SPK_  [TP/SMD/D1.0]  (value not drawn)
TP5  spk+  [TP/SMD/D1.0]  (value not drawn)
U9  LM4890  [MSOP8]
U35  LM358  [SOT96-1]  (parts A,B of 2)

### Nets
GND: C107.1 C108.1 C109.1 C110.1 C111.1 C114.1 C130.1 C132.1 C137.1 J3.3 J3.4 R62.1 R63.2 R102.2 U9.7(GND) U35.4(GND)
VBUS: FB8.2
VCCA: C132.2 C137.2 FB4.2 R101.1 U35.8(VCC)
VDDIO33: FB4.1  [project net AVDD33]
AMP_MICINN: C128.1 C131.1 R124.2 U35.1(OUT)
AMP_MICINP: C127.1 R126.2 U35.7(OUT)
MIC+: C104.1 R127.1 R130.1
MIC-: C106.1 R123.1 R169.1
MIC_REF: C130.2 R101.2 R102.1 R170.1 U35.5(+IN)
MICBIAS: R60.1 ; off-sheet MICBIAS
MICI_N: C105.1 C106.2 C107.2 MIC1.2 R62.2
MICI_P: C104.2 C105.2 C108.2 MIC1.1 R61.2
MICINN: C131.2 R169.2 ; off-sheet MICINN
MICINP: C127.2 R130.2 ; off-sheet MICINP
PA_SHDN: R63.1 U9.1(SHDN#) ; off-sheet PA_SHDN
PA_VDD: C114.2 FB8.1 U9.6(VDD)
SPK+: J3.1 R65.2 TP5.1 U9.5(VO1)
SPK-: J3.2 TP4.1 U9.8(VO2)
VMICBIAS: C109.2 C110.2 R60.2 R61.1
VOML_LINE0: C113.1 ; off-sheet VOML_LINE0
VOPL_LINE0: C112.1 ; off-sheet VOPL_LINE0
NetC111_2: C111.2 R64.1 U9.2(BYPASS)
NetC112_2: C112.2 R66.1
NetC113_2: C113.2 R67.1
NetC128_2: C128.2 R125.1
NetR64_2: R64.2 R66.2 U9.3(IN+)
NetR65_1: R65.1 R67.2 U9.4(IN-)
NetR123_2: R123.2 R124.1 U35.2(-IN)
NetR125_2: R125.2 R126.1 U35.6(-IN)
NetR127_2: R127.2 R170.2 U35.3(+IN)

### Notes on the sheet
- MIC & AUDIO
- MIC
- SPEAKER
- 深圳市森国科科技股份有限公司
- (in symbol LM358_0, part A) -; +
- (in symbol LM358_0, part B) -; +
- (in symbol TitleBlock0) Title; Size; Document Number; Rev; Date:; Sheet; of

### Library data of the parts
C104-C110 C127 C128 C130-C132 C137 = CAPACITOR_0_Dup3
C111 = CAPACITOR_0_Dup2: 规格型号: 原材料; 元件类别: 电容1UF/6.3V,X5R,±10%,0402 每盘10K; 元件编号: 电容; 备注: YCL0457; PAGE: 1; Vendor: C0402
C112 = CAPACITOR_0_Dup2: PAGE: 1; 备注: YCL0816; 元件编号: 电容; 元件类别: 电容470nF/10V,X5R,±10%,0402 每盘10K; 规格型号: 原材料; Vendor: C0402
C113 = CAPACITOR_0_Dup2: 规格型号: 原材料; 元件类别: 电容470nF/10V,X5R,±10%,0402 每盘10K; 元件编号: 电容; 备注: YCL0816; PAGE: 1; Vendor: C0402
C114 = CAPACITOR_0_Dup2: 规格型号: 原材料; 元件类别: 电容2.2UF/6.3V,X5R,±20%,0402 每盘10K; 元件编号: 电容; Vendor: C0402; 备注: YCL0302; PAGE: 1
FB4 = Ferrite BEAD
FB8 = INDUCTOR_0: RoHS BEAD/600ohm 100Mhz Z=600Ω DCR<0.2Ω 800mA SMT L0603; OriginalSymbolOrigin: (10,0); Pin Names Rotate: TRUE; Pin Names Visible: FALSE; Pin Numbers Visible: TRUE; Package: SMT
J3 = CON4
MIC1 = MIC_0: Type: 麦克风
R60-R62 R123-R127 R130 R169 R170 = RESISTOR_Dup2
R63 R101 R102 = ?_0: as R82 on sheet P14 FLASH & TF & GSENSO; Vendor: R0402
R64 R66 = ?_0: 规格型号: 原材料; 元件类别: 电阻20K,±5%,1/16W,0402 每盘10K; 元件编号: 电阻; 备注: YCL0479; Vendor: R0402
R65 = ?_0: 规格型号: 原材料; 元件类别: 电阻33K,±5%,1/16W,0402 每盘10K; 元件编号: 电阻; 备注: YCL0466; Vendor: R0402
R67 = ?_0: 备注: YCL0479; 元件编号: 电阻; 元件类别: 电阻20K,±5%,1/16W,0402 每盘10K; 规格型号: 原材料; Vendor: R0402
TP4 TP5 = TP_0: Part Description: Test Point; Type: NC
U9 = LY8006_0: 备注: YCL0064; 元件编号: IC; 元件类别: 功放IC4890 / TF690; 规格型号: 原材料; Vendor: MSOP8
U35 = LM358_0
*#5 = TitleBlock0: Page Create Date: March  8, 1995

## Sheet P12 MIPI LCD.SchDoc
size 420 x 297 mm
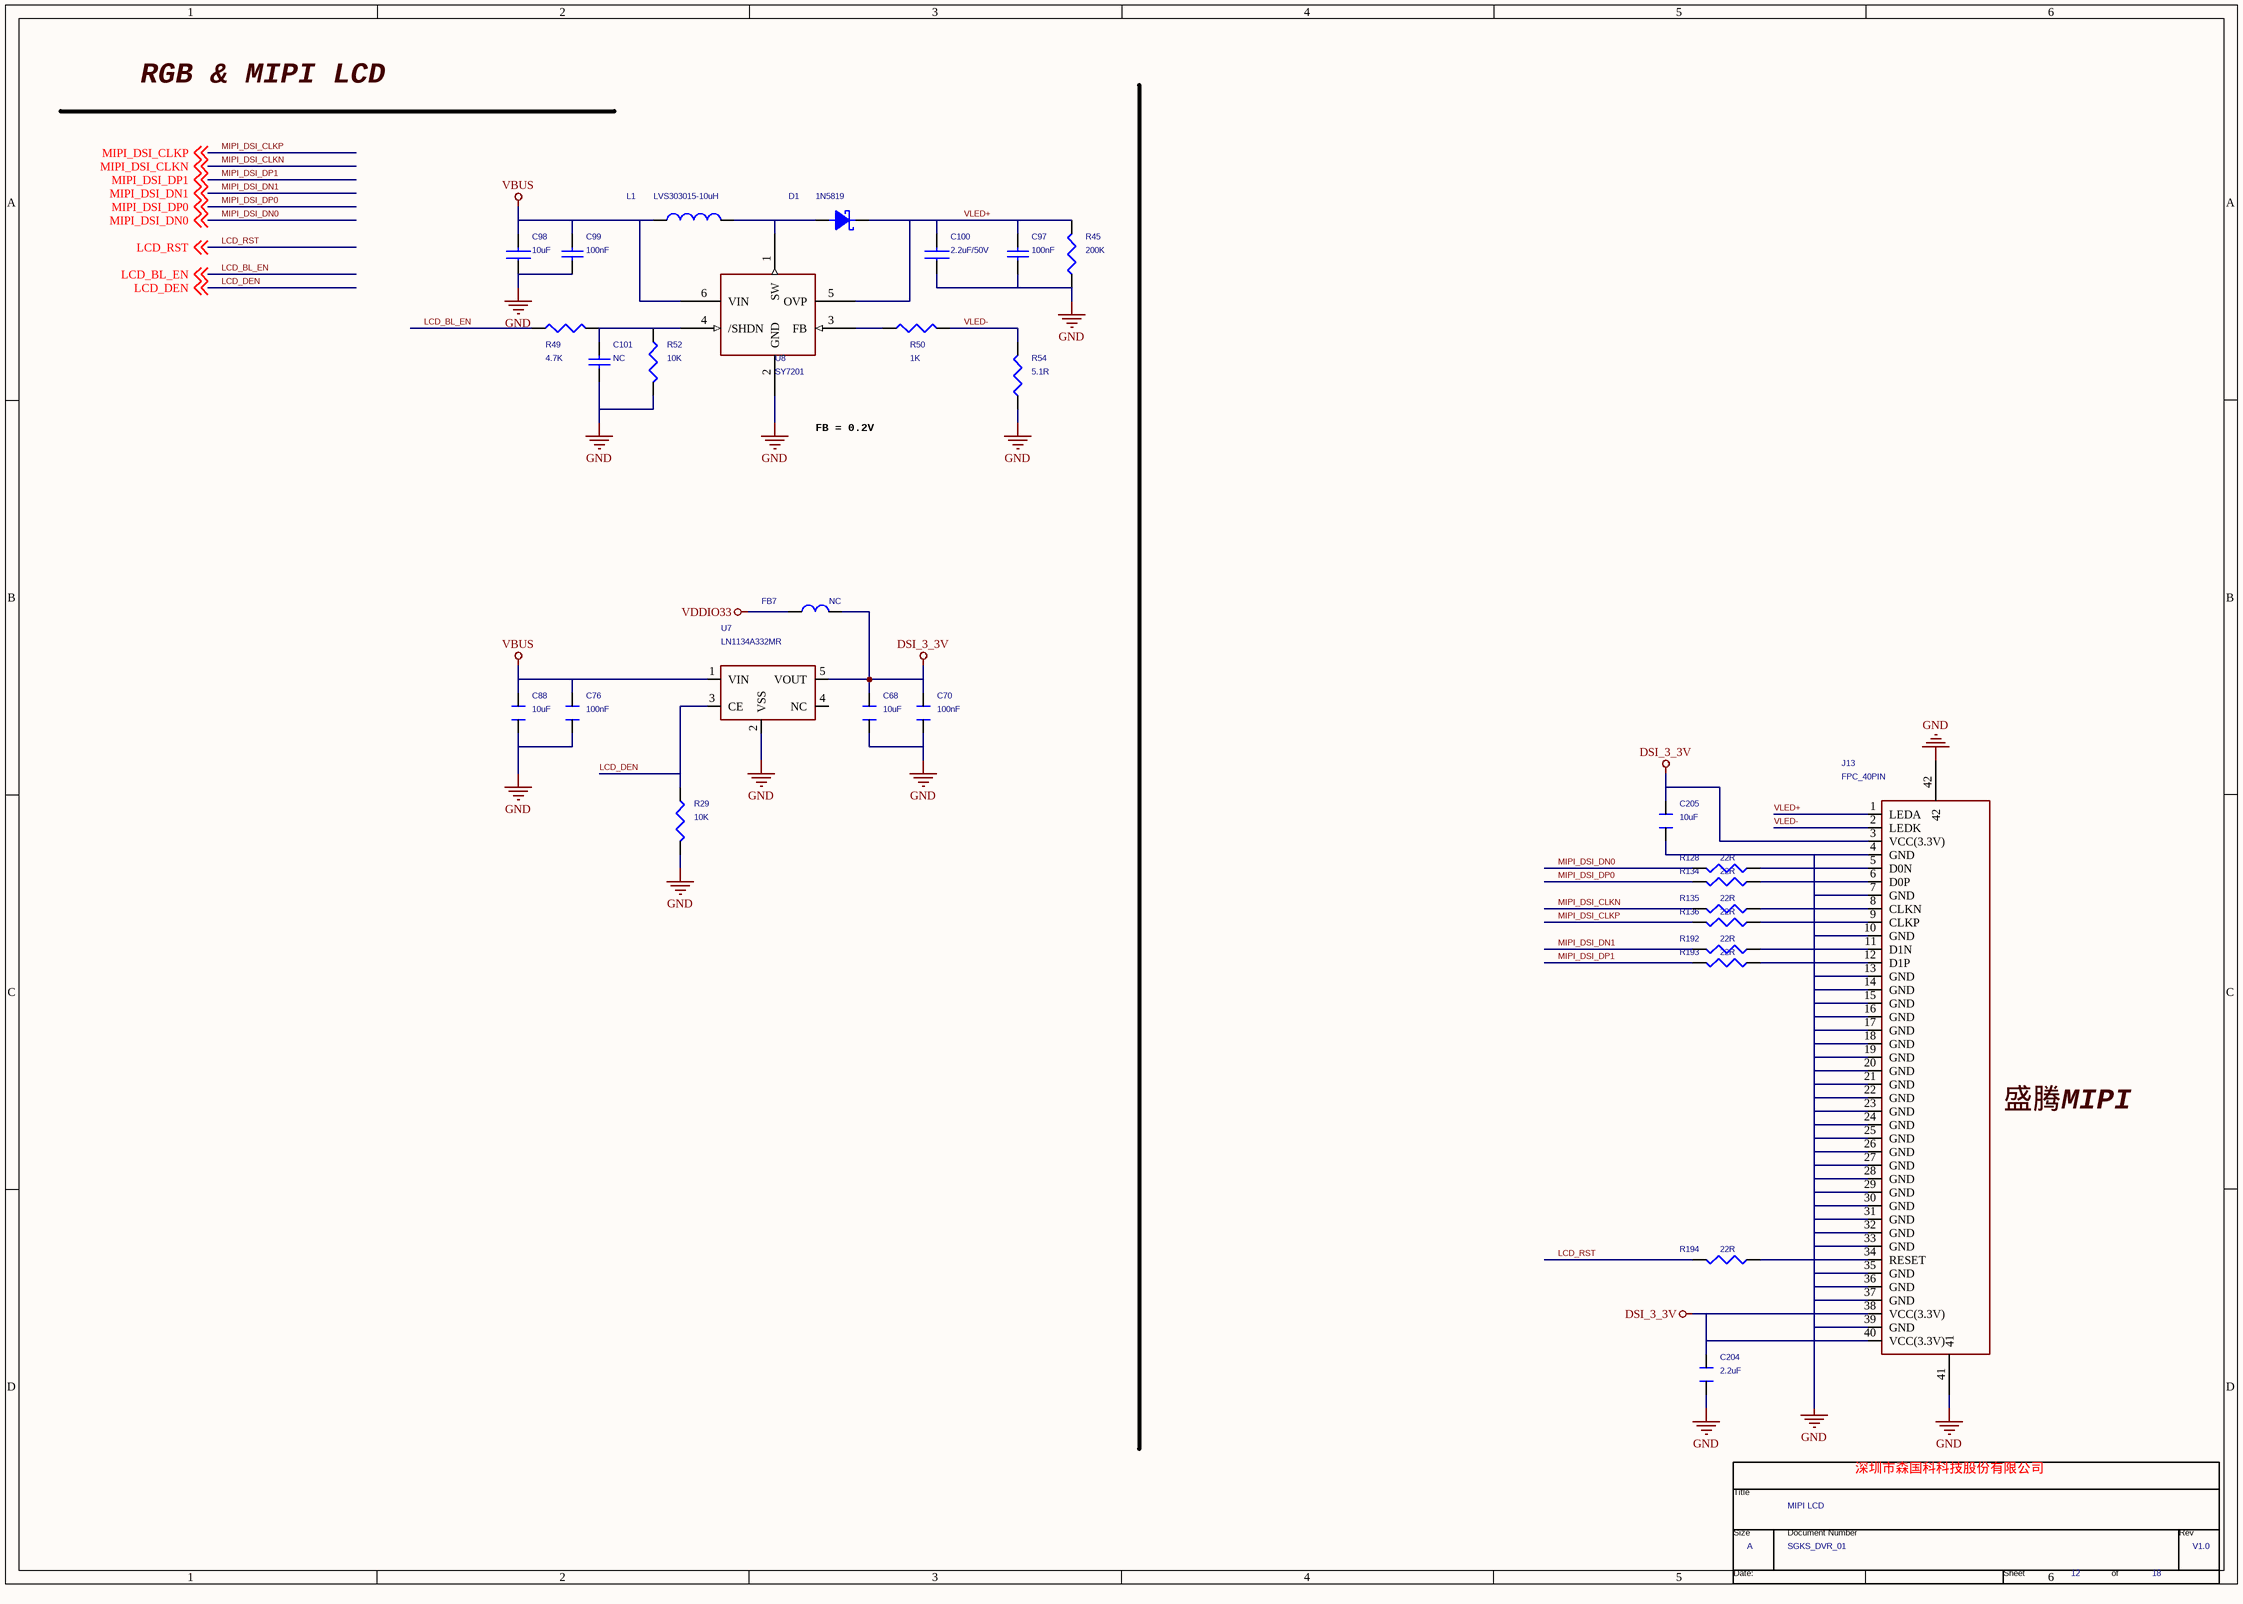
[diagram p5: P12 MIPI LCD.SchDoc]

### Parts
(Parts that share a designator on the sheet are numbered #1, #2 ... from top to bottom, then left to right.)
*#6  Page Count: 18  Page Number: 12  Page Size: A  Title: MIPI LCD  RevCode: V1.0  Doc: SGKS_DVR_01  (hidden comment: TitleBlock0)  (graphical)
C68  10uF  [C0603]
C70  100nF  [C0402]
C76  100nF  [C0402]
C88  10uF  [C0603]
C97  100nF  [C0402]
C98  10uF  [C0603]
C99  100nF  [C0402]
C100  2.2uF/50V  [C0603]
C101  NC  [C0402]
C204  2.2uF  [C0603]
C205  10uF  [C0603]
D1  1N5819  [SMD/1210D]
FB7  NC  [0805]
J13  FPC_40PIN  [FPC-40PIN-0.5MM]
L1  LVS303015-10uH  [PL4X4]
R29  10K  [R0603/SMD]
R45  200K  [R0402]
R49  4.7K  [R0603/SMD]
R50  1K  [R0603/SMD]
R52  10K  [R0603/SMD]
R54  5.1R  [R0603]
R128  22R  [R0603/SMD]
R134  22R  [R0603/SMD]
R135  22R  [R0603/SMD]
R136  22R  [R0603/SMD]
R192  22R  [R0603/SMD]
R193  22R  [R0603/SMD]
R194  22R  [R0603/SMD]
U7  LN1134A332MR  [SOT23-6]
U8  SY7201  [SOT-23-5]

### Nets
DSI_3_3V: C68.2 C70.2 C204.2 C205.2 FB7.2 J13.3(VCC(3.3V)) J13.38(VCC(3.3V)) J13.40(VCC(3.3V)) U7.5(VOUT)
GND: C68.1 C70.1 C76.1 C88.1 C97.2 C98.1 C99.2 C100.1 C101.2 C204.1 C205.1 J13.4(GND) J13.7(GND) J13.10(GND) J13.13(GND) J13.14(GND) J13.15(GND) J13.16(GND) J13.17(GND) J13.18(GND) J13.19(GND) J13.20(GND) J13.21(GND) J13.22(GND) J13.23(GND) J13.24(GND) J13.25(GND) J13.26(GND) J13.27(GND) J13.28(GND) J13.29(GND) J13.30(GND) J13.31(GND) J13.32(GND) J13.33(GND) J13.35(GND) J13.36(GND) J13.37(GND) J13.39(GND) J13.41 J13.42 R29.2 R45.1 R52.2 R54.1 U7.2(VSS) U8.2(GND)
VBUS: C76.2 C88.2 C98.2 C99.1 L1.2 U7.1(VIN) U8.6(VIN)
VDDIO33: FB7.1  [project net AVDD33]
LCD_BL_EN: R49.1 ; off-sheet LCD_BL_EN
LCD_DEN: R29.1 U7.3(CE) ; off-sheet LCD_DEN
LCD_RST: R194.2 ; off-sheet LCD_RST
MIPI_DSI_CLKN: R135.2 ; off-sheet MIPI_DSI_CLKN
MIPI_DSI_CLKP: R136.2 ; off-sheet MIPI_DSI_CLKP
MIPI_DSI_DN0: R128.2 ; off-sheet MIPI_DSI_DN0
MIPI_DSI_DN1: R192.2 ; off-sheet MIPI_DSI_DN1
MIPI_DSI_DP0: R134.2 ; off-sheet MIPI_DSI_DP0
MIPI_DSI_DP1: R193.2 ; off-sheet MIPI_DSI_DP1
VLED+: C97.1 C100.2 D1.2(CATHODE) J13.1(LEDA) R45.2 U8.5(OVP)
VLED-: J13.2(LEDK) R50.2 R54.2
NetC101_1: C101.1 R49.2 R52.1 U8.4(/SHDN)
NetD1_1: D1.1(ANODE) L1.1 U8.1(SW)
NetJ13_5: J13.5(D0N) R128.1
NetJ13_6: J13.6(D0P) R134.1
NetJ13_8: J13.8(CLKN) R135.1
NetJ13_9: J13.9(CLKP) R136.1
NetJ13_11: J13.11(D1N) R192.1
NetJ13_12: J13.12(D1P) R193.1
NetJ13_34: J13.34(RESET) R194.1
NetR50_1: R50.1 U8.3(FB)

Not connected (* = marked no-connect by the designer): U7 4(NC)

### Notes on the sheet
- RGB & MIPI LCD
- FB = 0.2V
- 盛腾MIPI
- 深圳市森国科科技股份有限公司
- (in symbol TitleBlock0) Title; Size; Document Number; Rev; Date:; Sheet; of

### Library data of the parts
C68 C70 C76 C88 C204 C205 = CAPACITOR: PAGE: 1
C97 C99 C101 = CAP/CB_0: Part Description: Chip Capacitor
C98 = CAP NP_0: CLASS: DISCRETE; DEVICE: 0_1u
C100 = CAP NP_1_Dup1: DEVICE: 0_1u; CLASS: DISCRETE
D1 = DIODE/SCHOTTKY
FB7 = Ferrite BEAD
J13 = CN30PIN_1
L1 = INDUCTOR_Dup1
R29 = RES/SMD_1: Part Description: Chip Resistor; Type: 贴片电阻
R45 R54 = RESISTOR_Dup2
R49 R50 R52 R128 R134-R136 R192-R194 = RES/SMD_0: Part Description: Chip Resistor
  R49 R50 R52: Type: 贴片电阻
U7 = RT9266PE_0
U8 = RT8008_0
*#6 = TitleBlock0: Page Create Date: March  8, 1995

## Sheet P11 CMOS SENSOR.SchDoc
size 297 x 209 mm
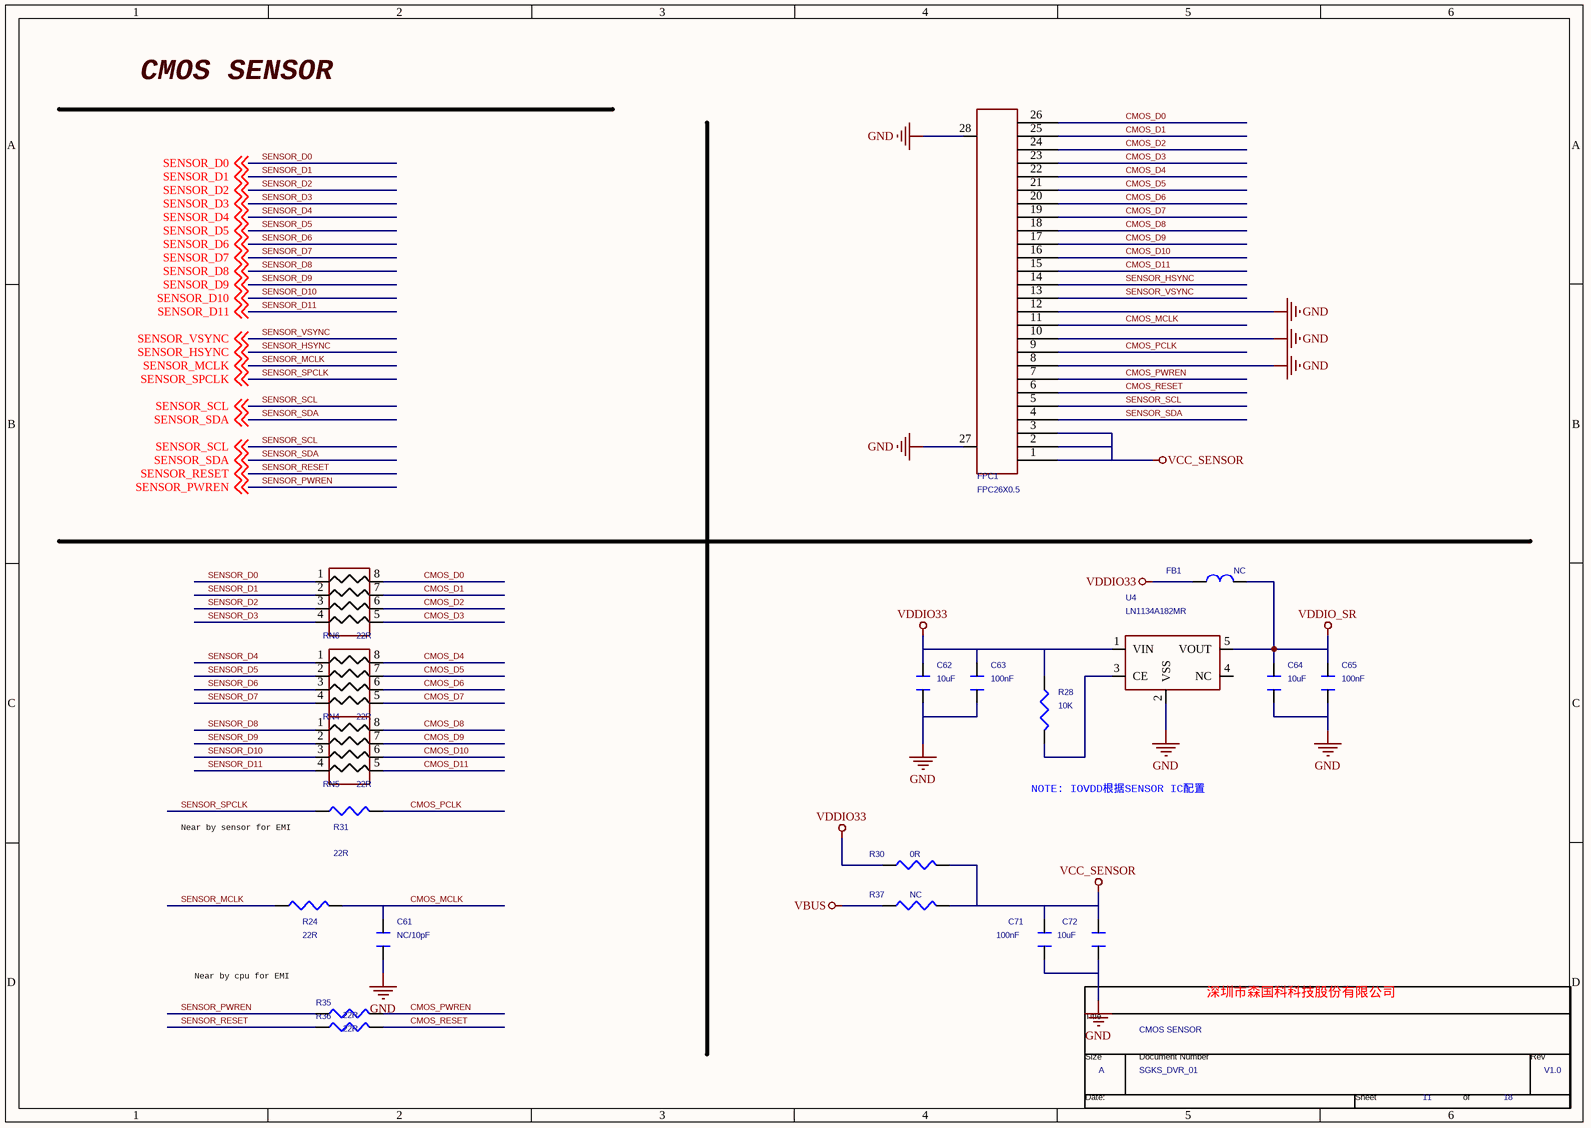
[diagram p6: P11 CMOS SENSOR.SchDoc]

### Parts
(Parts that share a designator on the sheet are numbered #1, #2 ... from top to bottom, then left to right.)
*#7  Page Count: 18  Page Number: 11  Page Size: A  Title: CMOS SENSOR  RevCode: V1.0  Doc: SGKS_DVR_01  (hidden comment: TitleBlock0)  (graphical)
C61  NC/10pF  [C0402]
C62  10uF  [C0603]
C63  100nF  [C0402]
C64  10uF  [C0603]
C65  100nF  [C0402]
C71  100nF  [C0402]
C72  10uF  [C0603]
FB1  NC  [0805]
FPC1  FPC26X0.5  [FPC_26PIN]
R24  22R  [R0603/SMD]
R28  10K  [R0603/SMD]
R30  0R  [R0603/SMD]
R31  22R  [R0603/SMD]
R35  22R  [R0603/SMD]
R36  22R  [R0603/SMD]
R37  NC  [R0603/SMD]
RN4  22R  [0402-8P4R]
RN5  22R  [0402-8P4R]
RN6  22R  [0402-8P4R]
U4  LN1134A182MR  [SOT23-6]

### Nets
GND: C61.1 C62.1 C63.1 C64.1 C65.1 C71.1 C72.1 FPC1.8 FPC1.10 FPC1.12 FPC1.27 FPC1.28 U4.2(VSS)
VBUS: R37.1
VCC_SENSOR: C71.2 C72.2 FPC1.1 FPC1.2 FPC1.3 R30.2 R37.2
VDDIO33: C62.2 C63.2 FB1.1 R28.1 R30.1 U4.1(VIN)  [project net AVDD33]
VDDIO_SR: C64.2 C65.2 FB1.2 U4.5(VOUT)
CMOS_D0: FPC1.26 RN6.8
CMOS_D1: FPC1.25 RN6.7
CMOS_D2: FPC1.24 RN6.6
CMOS_D3: FPC1.23 RN6.5
CMOS_D4: FPC1.22 RN4.8
CMOS_D5: FPC1.21 RN4.7
CMOS_D6: FPC1.20 RN4.6
CMOS_D7: FPC1.19 RN4.5
CMOS_D8: FPC1.18 RN5.8
CMOS_D9: FPC1.17 RN5.7
CMOS_D10: FPC1.16 RN5.6
CMOS_D11: FPC1.15 RN5.5
CMOS_MCLK: C61.2 FPC1.11 R24.2
CMOS_PCLK: FPC1.9 R31.1
CMOS_PWREN: FPC1.7 R35.1
CMOS_RESET: FPC1.6 R36.1
SENSOR_D0: RN6.1 ; off-sheet SENSOR_D0
SENSOR_D1: RN6.2 ; off-sheet SENSOR_D1
SENSOR_D2: RN6.3 ; off-sheet SENSOR_D2
SENSOR_D3: RN6.4 ; off-sheet SENSOR_D3
SENSOR_D4: RN4.1 ; off-sheet SENSOR_D4
SENSOR_D5: RN4.2 ; off-sheet SENSOR_D5
SENSOR_D6: RN4.3 ; off-sheet SENSOR_D6
SENSOR_D7: RN4.4 ; off-sheet SENSOR_D7
SENSOR_D8: RN5.1 ; off-sheet SENSOR_D8
SENSOR_D9: RN5.2 ; off-sheet SENSOR_D9
SENSOR_D10: RN5.3 ; off-sheet SENSOR_D10
SENSOR_D11: RN5.4 ; off-sheet SENSOR_D11
SENSOR_HSYNC: FPC1.14 ; off-sheet SENSOR_HSYNC
SENSOR_MCLK: R24.1 ; off-sheet SENSOR_MCLK
SENSOR_PWREN: R35.2 ; off-sheet SENSOR_PWREN
SENSOR_RESET: R36.2 ; off-sheet SENSOR_RESET
SENSOR_SCL: FPC1.5 ; off-sheet SENSOR_SCL
SENSOR_SDA: FPC1.4 ; off-sheet SENSOR_SDA
SENSOR_SPCLK: R31.2 ; off-sheet SENSOR_SPCLK
SENSOR_VSYNC: FPC1.13 ; off-sheet SENSOR_VSYNC
NetR28_2: R28.2 U4.3(CE)

Not connected (* = marked no-connect by the designer): U4 4(NC)

### Notes on the sheet
- CMOS SENSOR
- NOTE: IOVDD根据SENSOR IC配置
- Near by sensor for EMI
- Near by cpu for EMI
- 深圳市森国科科技股份有限公司
- (in symbol TitleBlock0) Title; Size; Document Number; Rev; Date:; Sheet; of

### Library data of the parts
C61-C65 C71 C72 = CAPACITOR: PAGE: 1
FB1 = Ferrite BEAD
FPC1 = CON40_2
R24 R31 R35 R36 = RES/SMD_0: Part Description: Chip Resistor
R28 R30 R37 = RES/SMD_1: Part Description: Chip Resistor; Type: 贴片电阻
RN4-RN6 = 742C083/SM_0: Page: 10
U4 = RT9266PE_0
*#7 = TitleBlock0: Page Create Date: March  8, 1995

## Sheet P10 PR2000K_MIPI.SchDoc
size 420 x 297 mm
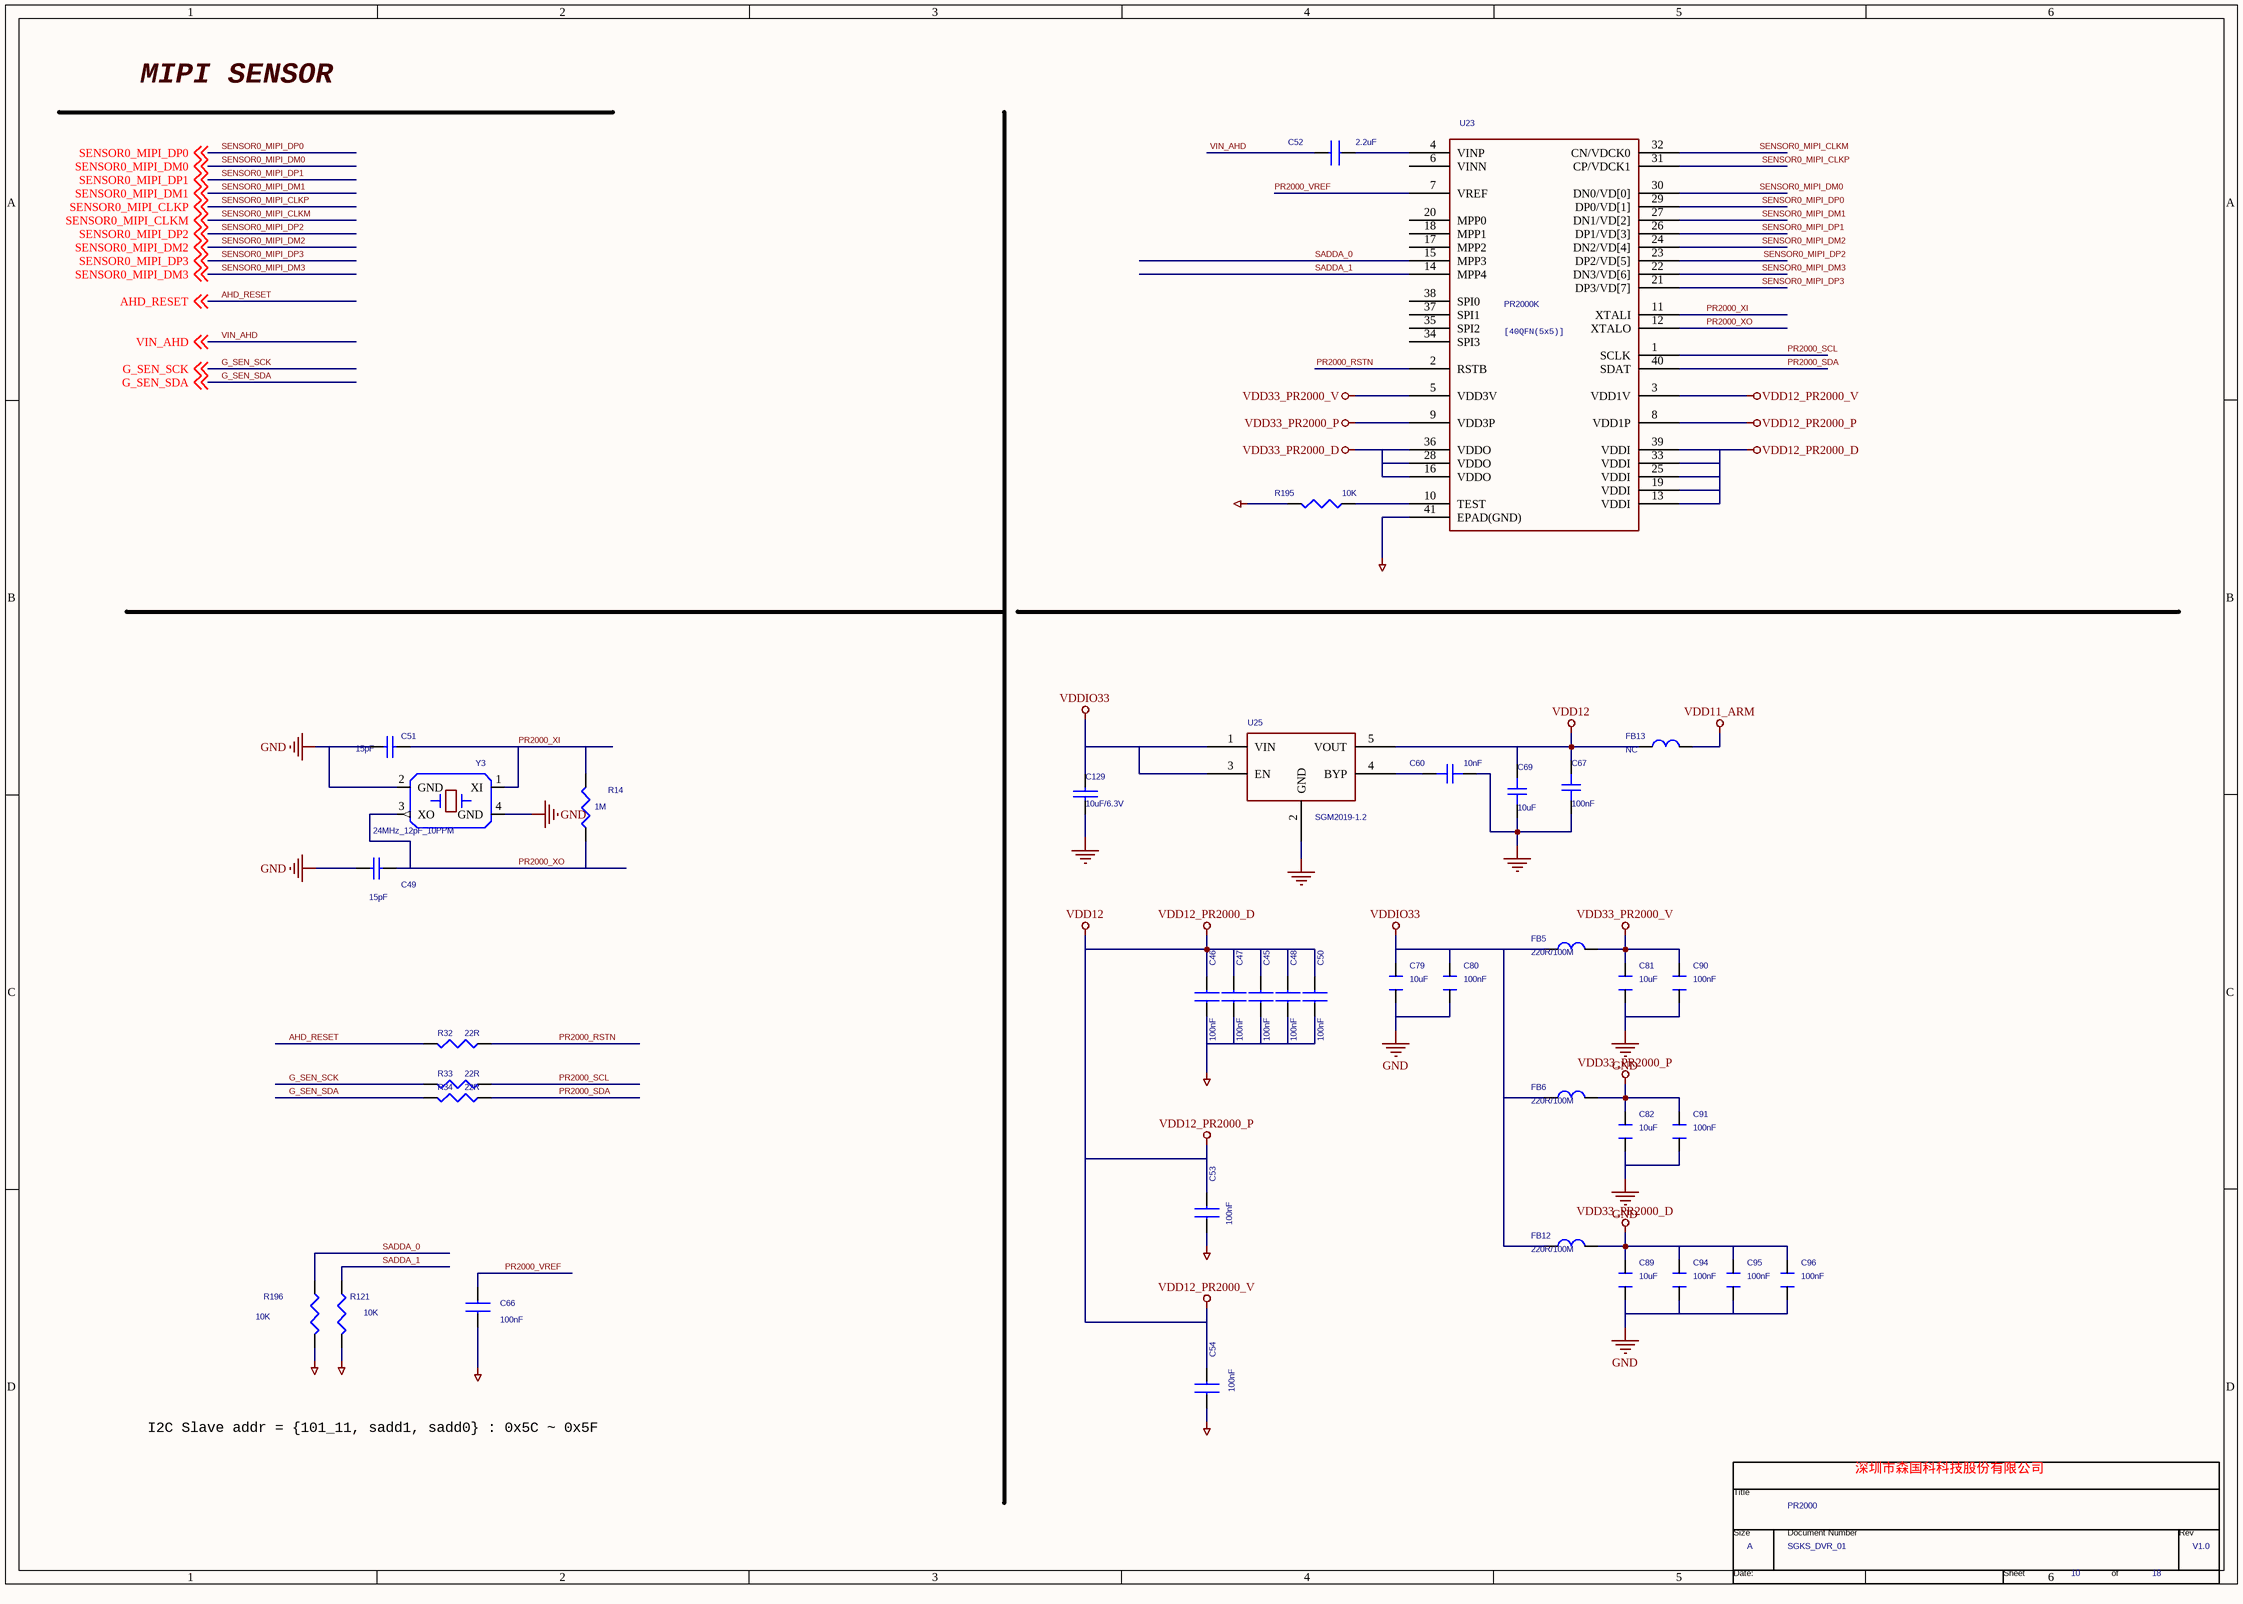
[diagram p7: P10 PR2000K_MIPI.SchDoc]

### Parts
(Parts that share a designator on the sheet are numbered #1, #2 ... from top to bottom, then left to right.)
*#8  Page Count: 18  Page Number: 10  Page Size: A  Title: PR2000  RevCode: V1.0  Doc: SGKS_DVR_01  (hidden comment: TitleBlock0)  (graphical)
C45  100nF  [C0603]
C46  100nF  [C0603]
C47  100nF  [C0603]
C48  100nF  [C0603]
C49  15pF  [C0402]
C50  100nF  [C0603]
C51  15pF  [C0402]
C52  2.2uF  [C0603]
C53  100nF  [C0603]
C54  100nF  [C0603]
C60  10nF  [0402C]
C66  100nF  [C0603]
C67  100nF  [0402C]
C69  10uF  [0603C]
C79  10uF  [C0603]
C80  100nF  [C0402]
C81  10uF  [C0603]
C82  10uF  [C0603]
C89  10uF  [C0603]
C90  100nF  [C0402]
C91  100nF  [C0402]
C94  100nF  [C0402]
C95  100nF  [C0402]
C96  100nF  [C0402]
C129  10uF/6.3V  [1206C]
FB5  220R/100M  [0805]
FB6  220R/100M  [0805]
FB12  220R/100M  [0805]
FB13  NC  [0805]
R14  1M  [R0603/SMD]
R32  22R  [R0603/SMD]
R33  22R  [R0603/SMD]
R34  22R  [R0603/SMD]
R121  10K  [R1005]
R195  10K  [R1005]
R196  10K  [R1005]
U23  PR2000K  [QFN40_PR2000]
U25  SGM2019-1.2  [SOT23-5]
Y3  24MHz_12pF_10PPM  [OSC4_SMD_50X32]

### Nets
GND: C45.1 C46.1 C47.1 C48.1 C49.2 C50.1 C51.2 C53.1 C54.1 C60.2 C66.1 C67.2 C69.2 C79.1 C80.1 C81.1 C82.1 C89.1 C90.1 C91.1 C94.1 C95.1 C96.1 C129.2 R121.1 R195.2 R196.1 U23.41(EPAD(GND)) U25.2(GND) Y3.2(GND) Y3.4(GND)
VDD11_ARM: FB13.2  [project net DVDD_DDR]
VDD12: C45.2 C46.2 C47.2 C48.2 C50.2 C53.2 C54.2 C67.1 C69.1 FB13.1 U23.3(VDD1V) U23.8(VDD1P) U23.13(VDDI) U23.19(VDDI) U23.25(VDDI) U23.33(VDDI) U23.39(VDDI) U25.5(VOUT)  [also labelled VDD12_PR2000_D, VDD12_PR2000_P, VDD12_PR2000_V]
VDD33_PR2000_D: C89.2 C94.2 C95.2 C96.2 FB12.2 U23.16(VDDO) U23.28(VDDO) U23.36(VDDO)
VDD33_PR2000_P: C82.2 C91.2 FB6.2 U23.9(VDD3P)
VDD33_PR2000_V: C81.2 C90.2 FB5.2 U23.5(VDD3V)
VDDIO33: C79.2 C80.2 C129.1 FB5.1 FB6.1 FB12.1 U25.1(VIN) U25.3(EN)  [project net AVDD33]
AHD_RESET: R32.2 ; off-sheet AHD_RESET
G_SEN_SCK: R33.2 ; off-sheet G_SEN_SCK
G_SEN_SDA: R34.2 ; off-sheet G_SEN_SDA
PR2000_RSTN: R32.1 U23.2(RSTB)
PR2000_SCL: R33.1 U23.1(SCLK)
PR2000_SDA: R34.1 U23.40(SDAT)
PR2000_VREF: C66.2 U23.7(VREF)
PR2000_XI: C51.1 R14.1 U23.11(XTALI) Y3.1(XI)
PR2000_XO: C49.1 R14.2 U23.12(XTALO) Y3.3(XO)
SADDA_0: R196.2 U23.15(MPP3)
SADDA_1: R121.2 U23.14(MPP4)
SENSOR0_MIPI_CLKM: U23.32(CN/VDCK0) ; off-sheet SENSOR0_MIPI_CLKM
SENSOR0_MIPI_CLKP: U23.31(CP/VDCK1) ; off-sheet SENSOR0_MIPI_CLKP
SENSOR0_MIPI_DM0: U23.30(DN0/VD[0]) ; off-sheet SENSOR0_MIPI_DM0
SENSOR0_MIPI_DM1: U23.27(DN1/VD[2]) ; off-sheet SENSOR0_MIPI_DM1
SENSOR0_MIPI_DM2: U23.24(DN2/VD[4]) ; off-sheet SENSOR0_MIPI_DM2
SENSOR0_MIPI_DM3: U23.22(DN3/VD[6]) ; off-sheet SENSOR0_MIPI_DM3
SENSOR0_MIPI_DP0: U23.29(DP0/VD[1]) ; off-sheet SENSOR0_MIPI_DP0
SENSOR0_MIPI_DP1: U23.26(DP1/VD[3]) ; off-sheet SENSOR0_MIPI_DP1
SENSOR0_MIPI_DP2: U23.23(DP2/VD[5]) ; off-sheet SENSOR0_MIPI_DP2
SENSOR0_MIPI_DP3: U23.21(DP3/VD[7]) ; off-sheet SENSOR0_MIPI_DP3
VIN_AHD: C52.1 ; off-sheet VIN_AHD
NetC52_2: C52.2 U23.4(VINP)
NetC60_1: C60.1 U25.4(BYP)
NetR195_1: R195.1 U23.10(TEST)

Not connected (* = marked no-connect by the designer): U23 6(VINN) 17(MPP2) 18(MPP1) 20(MPP0) 34(SPI3) 35(SPI2) 37(SPI1) 38(SPI0)

### Notes on the sheet
- MIPI SENSOR
- I2C Slave addr = {101_11, sadd1, sadd0} : 0x5C ~ 0x5F
- 深圳市森国科科技股份有限公司
- (in symbol PR2000K_0) [40QFN(5x5)]
- (in symbol TitleBlock0) Title; Size; Document Number; Rev; Date:; Sheet; of

### Library data of the parts
C45-C48 C50 C52-C54 C66 = CAP NP_1: ROOM: CHG
C49 C51 = CAP/CB_0: Part Description: Chip Capacitor
C60 = 1210_10nF10%-0402-X7R-50V: Part1: 电容-10nF±10%-0402-X7R-50V; Part2: A.01.02.01.210
C67 = 1241_100nF10%-0402-X7R-16V: Part1: 电容-100nF±10%-0402-X7R-16V; ROOM: XM310; Part2: A.01.02.01.241
C69 = 1341_10uF20%-0603-X5R-6.3V: Part1: 电容-10uF±20%-0603-X5R-6.3V; ROOM: 3.3V_AVDD; Part2: A.01.02.01.341
C79-C82 C89-C91 C94-C96 = CAPACITOR: PAGE: 1
C129 = 10uF+80%/-20%-1206-Y5V-25V: Part1: 电容-10uF+80%/-20%-1206-Y5V-25V; Part2: A.02.04.01.202
FB5 FB6 FB12 FB13 = Ferrite BEAD
R14 R32-R34 = RES/SMD_0: Part Description: Chip Resistor
R121 R195 R196 = R1005_0
U23 = PR2000K_0
U25 = 2101_BL9193-3.3-SOT23-5: Part1: 集成电路-BL9193-33-A-A-X-RN-3.3VLDO-200mA-(SOT23-5); ROOM: 3.3V_AVDD; Part2: A.01.08.02.101
Y3 = CRYSTAL/4P: Type: 贴片晶振?
*#8 = TitleBlock0: Page Create Date: March  8, 1995

## Sheet P09 DDR3.SchDoc
size 386 x 246 mm
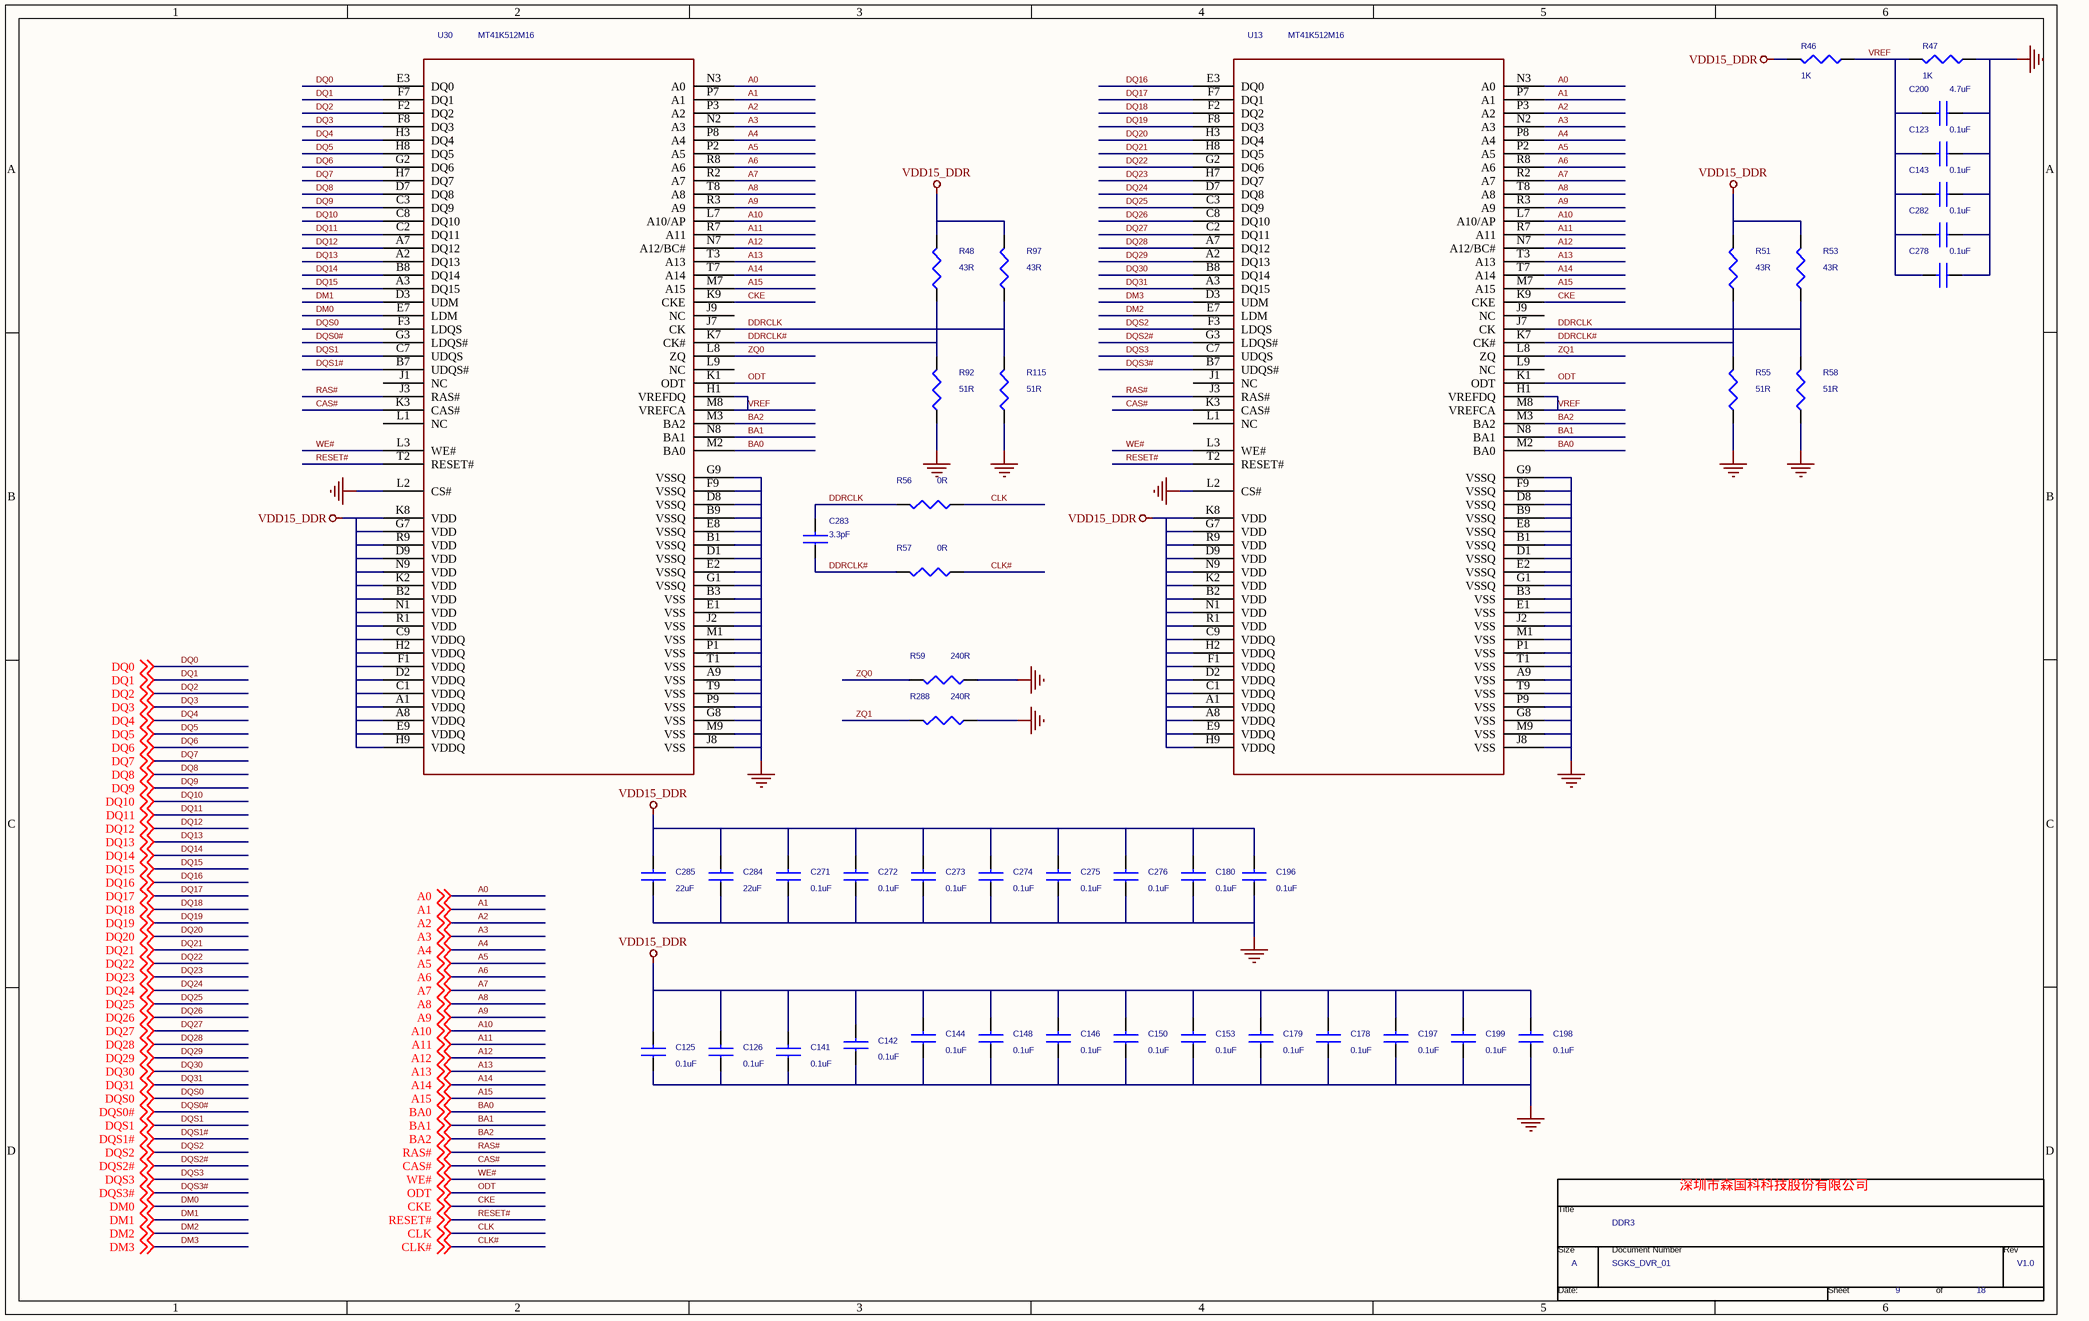
[diagram p8: P09 DDR3.SchDoc]

### Parts
(Parts that share a designator on the sheet are numbered #1, #2 ... from top to bottom, then left to right.)
*#9  Page Count: 18  Page Number: 9  Page Size: A  Title: DDR3  RevCode: V1.0  Doc: SGKS_DVR_01  (hidden comment: TitleBlock0)  (graphical)
C123  0.1uF  [C0402]
C125  0.1uF  [C0402]
C126  0.1uF  [C0402]
C141  0.1uF  [C0402]
C142  0.1uF  [C0402]
C143  0.1uF  [C0402]
C144  0.1uF  [C0402]
C146  0.1uF  [C0402]
C148  0.1uF  [C0402]
C150  0.1uF  [C0402]
C153  0.1uF  [C0402]
C178  0.1uF  [C0402]
C179  0.1uF  [C0402]
C180  0.1uF  [C0402]
C196  0.1uF  [C0402]
C197  0.1uF  [C0402]
C198  0.1uF  [C0402]
C199  0.1uF  [C0402]
C200  4.7uF  [C0603]
C271  0.1uF  [C0402]
C272  0.1uF  [C0402]
C273  0.1uF  [C0402]
C274  0.1uF  [C0402]
C275  0.1uF  [C0402]
C276  0.1uF  [C0402]
C278  0.1uF  [C0402]
C282  0.1uF  [C0402]
C283  3.3pF  [C0402]
C284  22uF  [C0603]
C285  22uF  [C0603]
R46  1K  [R0402]
R47  1K  [R0402]
R48  43R  [R0402]
R51  43R  [R0402]
R53  43R  [R0402]
R55  51R  [R0402]
R56  0R  [R0402]
R57  0R  [R0402]
R58  51R  [R0402]
R59  240R  [R0402]
R92  51R  [R0402]
R97  43R  [R0402]
R115  51R  [R0402]
R288  240R  [R0402]
U13  MT41K512M16  [SO16_1R27_10R3X10R3]
U30  MT41K512M16  [SO16_1R27_10R3X10R3]

### Nets
GND: C123.1 C125.1 C126.1 C141.1 C142.1 C143.1 C144.1 C146.1 C148.1 C150.1 C153.1 C178.1 C179.1 C180.1 C196.1 C197.1 C198.1 C199.1 C200.1 C271.1 C272.1 C273.1 C274.1 C275.1 C276.1 C278.1 C282.1 C284.1 C285.1 R47.1 R55.1 R58.1 R59.1 R92.1 R115.1 R288.1 U13.A9(VSS) U13.B1(VSSQ) U13.B3(VSS) U13.B9(VSSQ) U13.D1(VSSQ) U13.D8(VSSQ) U13.E1(VSS) U13.E2(VSSQ) U13.E8(VSSQ) U13.F9(VSSQ) U13.G1(VSSQ) U13.G8(VSS) U13.G9(VSSQ) U13.J2(VSS) U13.J8(VSS) U13.L2(CS#) U13.M1(VSS) U13.M9(VSS) U13.P1(VSS) U13.P9(VSS) U13.T1(VSS) U13.T9(VSS) U30.A9(VSS) U30.B1(VSSQ) U30.B3(VSS) U30.B9(VSSQ) U30.D1(VSSQ) U30.D8(VSSQ) U30.E1(VSS) U30.E2(VSSQ) U30.E8(VSSQ) U30.F9(VSSQ) U30.G1(VSSQ) U30.G8(VSS) U30.G9(VSSQ) U30.J2(VSS) U30.J8(VSS) U30.L2(CS#) U30.M1(VSS) U30.M9(VSS) U30.P1(VSS) U30.P9(VSS) U30.T1(VSS) U30.T9(VSS)
VDD15_DDR: C125.2 C126.2 C141.2 C142.2 C144.2 C146.2 C148.2 C150.2 C153.2 C178.2 C179.2 C180.2 C196.2 C197.2 C198.2 C199.2 C271.2 C272.2 C273.2 C274.2 C275.2 C276.2 C284.2 C285.2 R46.2 R48.2 R51.2 R53.2 R97.2 U13.A1(VDDQ) U13.A8(VDDQ) U13.B2(VDD) U13.C1(VDDQ) U13.C9(VDDQ) U13.D2(VDDQ) U13.D9(VDD) U13.E9(VDDQ) U13.F1(VDDQ) U13.G7(VDD) U13.H2(VDDQ) U13.H9(VDDQ) U13.K2(VDD) U13.K8(VDD) U13.N1(VDD) U13.N9(VDD) U13.R1(VDD) U13.R9(VDD) U30.A1(VDDQ) U30.A8(VDDQ) U30.B2(VDD) U30.C1(VDDQ) U30.C9(VDDQ) U30.D2(VDDQ) U30.D9(VDD) U30.E9(VDDQ) U30.F1(VDDQ) U30.G7(VDD) U30.H2(VDDQ) U30.H9(VDDQ) U30.K2(VDD) U30.K8(VDD) U30.N1(VDD) U30.N9(VDD) U30.R1(VDD) U30.R9(VDD)  [project net VDD15]
A0: U13.N3(A0) U30.N3(A0) ; off-sheet A0
A1: U13.P7(A1) U30.P7(A1) ; off-sheet A1
A2: U13.P3(A2) U30.P3(A2) ; off-sheet A2
A3: U13.N2(A3) U30.N2(A3) ; off-sheet A3
A4: U13.P8(A4) U30.P8(A4) ; off-sheet A4
A5: U13.P2(A5) U30.P2(A5) ; off-sheet A5
A6: U13.R8(A6) U30.R8(A6) ; off-sheet A6
A7: U13.R2(A7) U30.R2(A7) ; off-sheet A7
A8: U13.T8(A8) U30.T8(A8) ; off-sheet A8
A9: U13.R3(A9) U30.R3(A9) ; off-sheet A9
A10: U13.L7(A10/AP) U30.L7(A10/AP) ; off-sheet A10
A11: U13.R7(A11) U30.R7(A11) ; off-sheet A11
A12: U13.N7(A12/BC#) U30.N7(A12/BC#) ; off-sheet A12
A13: U13.T3(A13) U30.T3(A13) ; off-sheet A13
A14: U13.T7(A14) U30.T7(A14) ; off-sheet A14
A15: U13.M7(A15) U30.M7(A15) ; off-sheet A15
BA0: U13.M2(BA0) U30.M2(BA0) ; off-sheet BA0
BA1: U13.N8(BA1) U30.N8(BA1) ; off-sheet BA1
BA2: U13.M3(BA2) U30.M3(BA2) ; off-sheet BA2
CAS#: U13.K3(CAS#) U30.K3(CAS#) ; off-sheet CAS#
CKE: U13.K9(CKE) U30.K9(CKE) ; off-sheet CKE
CLK: R56.1 ; off-sheet CLK
CLK#: R57.1 ; off-sheet CLK#
DDRCLK: C283.2 R53.1 R56.2 R58.2 R97.1 R115.2 U13.J7(CK) U30.J7(CK)
DDRCLK#: C283.1 R48.1 R51.1 R55.2 R57.2 R92.2 U13.K7(CK#) U30.K7(CK#)
DM0: U30.E7(LDM) ; off-sheet DM0
DM1: U30.D3(UDM) ; off-sheet DM1
DM2: U13.E7(LDM) ; off-sheet DM2
DM3: U13.D3(UDM) ; off-sheet DM3
DQ0: U30.E3(DQ0) ; off-sheet DQ0
DQ1: U30.F7(DQ1) ; off-sheet DQ1
DQ2: U30.F2(DQ2) ; off-sheet DQ2
DQ3: U30.F8(DQ3) ; off-sheet DQ3
DQ4: U30.H3(DQ4) ; off-sheet DQ4
DQ5: U30.H8(DQ5) ; off-sheet DQ5
DQ6: U30.G2(DQ6) ; off-sheet DQ6
DQ7: U30.H7(DQ7) ; off-sheet DQ7
DQ8: U30.D7(DQ8) ; off-sheet DQ8
DQ9: U30.C3(DQ9) ; off-sheet DQ9
DQ10: U30.C8(DQ10) ; off-sheet DQ10
DQ11: U30.C2(DQ11) ; off-sheet DQ11
DQ12: U30.A7(DQ12) ; off-sheet DQ12
DQ13: U30.A2(DQ13) ; off-sheet DQ13
DQ14: U30.B8(DQ14) ; off-sheet DQ14
DQ15: U30.A3(DQ15) ; off-sheet DQ15
DQ16: U13.E3(DQ0) ; off-sheet DQ16
DQ17: U13.F7(DQ1) ; off-sheet DQ17
DQ18: U13.F2(DQ2) ; off-sheet DQ18
DQ19: U13.F8(DQ3) ; off-sheet DQ19
DQ20: U13.H3(DQ4) ; off-sheet DQ20
DQ21: U13.H8(DQ5) ; off-sheet DQ21
DQ22: U13.G2(DQ6) ; off-sheet DQ22
DQ23: U13.H7(DQ7) ; off-sheet DQ23
DQ24: U13.D7(DQ8) ; off-sheet DQ24
DQ25: U13.C3(DQ9) ; off-sheet DQ25
DQ26: U13.C8(DQ10) ; off-sheet DQ26
DQ27: U13.C2(DQ11) ; off-sheet DQ27
DQ28: U13.A7(DQ12) ; off-sheet DQ28
DQ29: U13.A2(DQ13) ; off-sheet DQ29
DQ30: U13.B8(DQ14) ; off-sheet DQ30
DQ31: U13.A3(DQ15) ; off-sheet DQ31
DQS0: U30.F3(LDQS) ; off-sheet DQS0
DQS0#: U30.G3(LDQS#) ; off-sheet DQS0#
DQS1: U30.C7(UDQS) ; off-sheet DQS1
DQS1#: U30.B7(UDQS#) ; off-sheet DQS1#
DQS2: U13.F3(LDQS) ; off-sheet DQS2
DQS2#: U13.G3(LDQS#) ; off-sheet DQS2#
DQS3: U13.C7(UDQS) ; off-sheet DQS3
DQS3#: U13.B7(UDQS#) ; off-sheet DQS3#
ODT: U13.K1(ODT) U30.K1(ODT) ; off-sheet ODT
RAS#: U13.J3(RAS#) U30.J3(RAS#) ; off-sheet RAS#
RESET#: U13.T2(RESET#) U30.T2(RESET#) ; off-sheet RESET#
VREF: C123.2 C143.2 C200.2 C278.2 C282.2 R46.1 R47.2 U13.H1(VREFDQ) U13.M8(VREFCA) U30.H1(VREFDQ) U30.M8(VREFCA)
WE#: U13.L3(WE#) U30.L3(WE#) ; off-sheet WE#
ZQ0: R59.2 U30.L8(ZQ)
ZQ1: R288.2 U13.L8(ZQ)

Not connected (* = marked no-connect by the designer): U13 J1(NC) J9(NC) L1(NC) L9(NC); U30 J1(NC) J9(NC) L1(NC) L9(NC)

### Notes on the sheet
- 深圳市森国科科技股份有限公司
- (in symbol TitleBlock0) Title; Size; Document Number; Rev; Date:; Sheet; of

### Library data of the parts
C123 C125 C126 C141-C144 C146 C148 C150 C153 C178-C180 C196-C200 C271-C276 C278 C282-C285 = CAP NP
R46 R55 R57-R59 R92 R115 = RESISTOR_Dup1: RES - 200 ohm 0603 1/16W 1%; Num Pins: 2; Page: 5
R47 R48 R51 R53 R56 R97 R288 = RESISTOR_Dup1: RES - 200 ohm 0603 1/16W 1%; Page: 5; Num Pins: 2
U13 U30 = S25FL128P0XM_2: Page: 5
*#9 = TitleBlock0: Page Create Date: March  8, 1995

## Sheet P08 CPU_4.SchDoc
size 420 x 297 mm
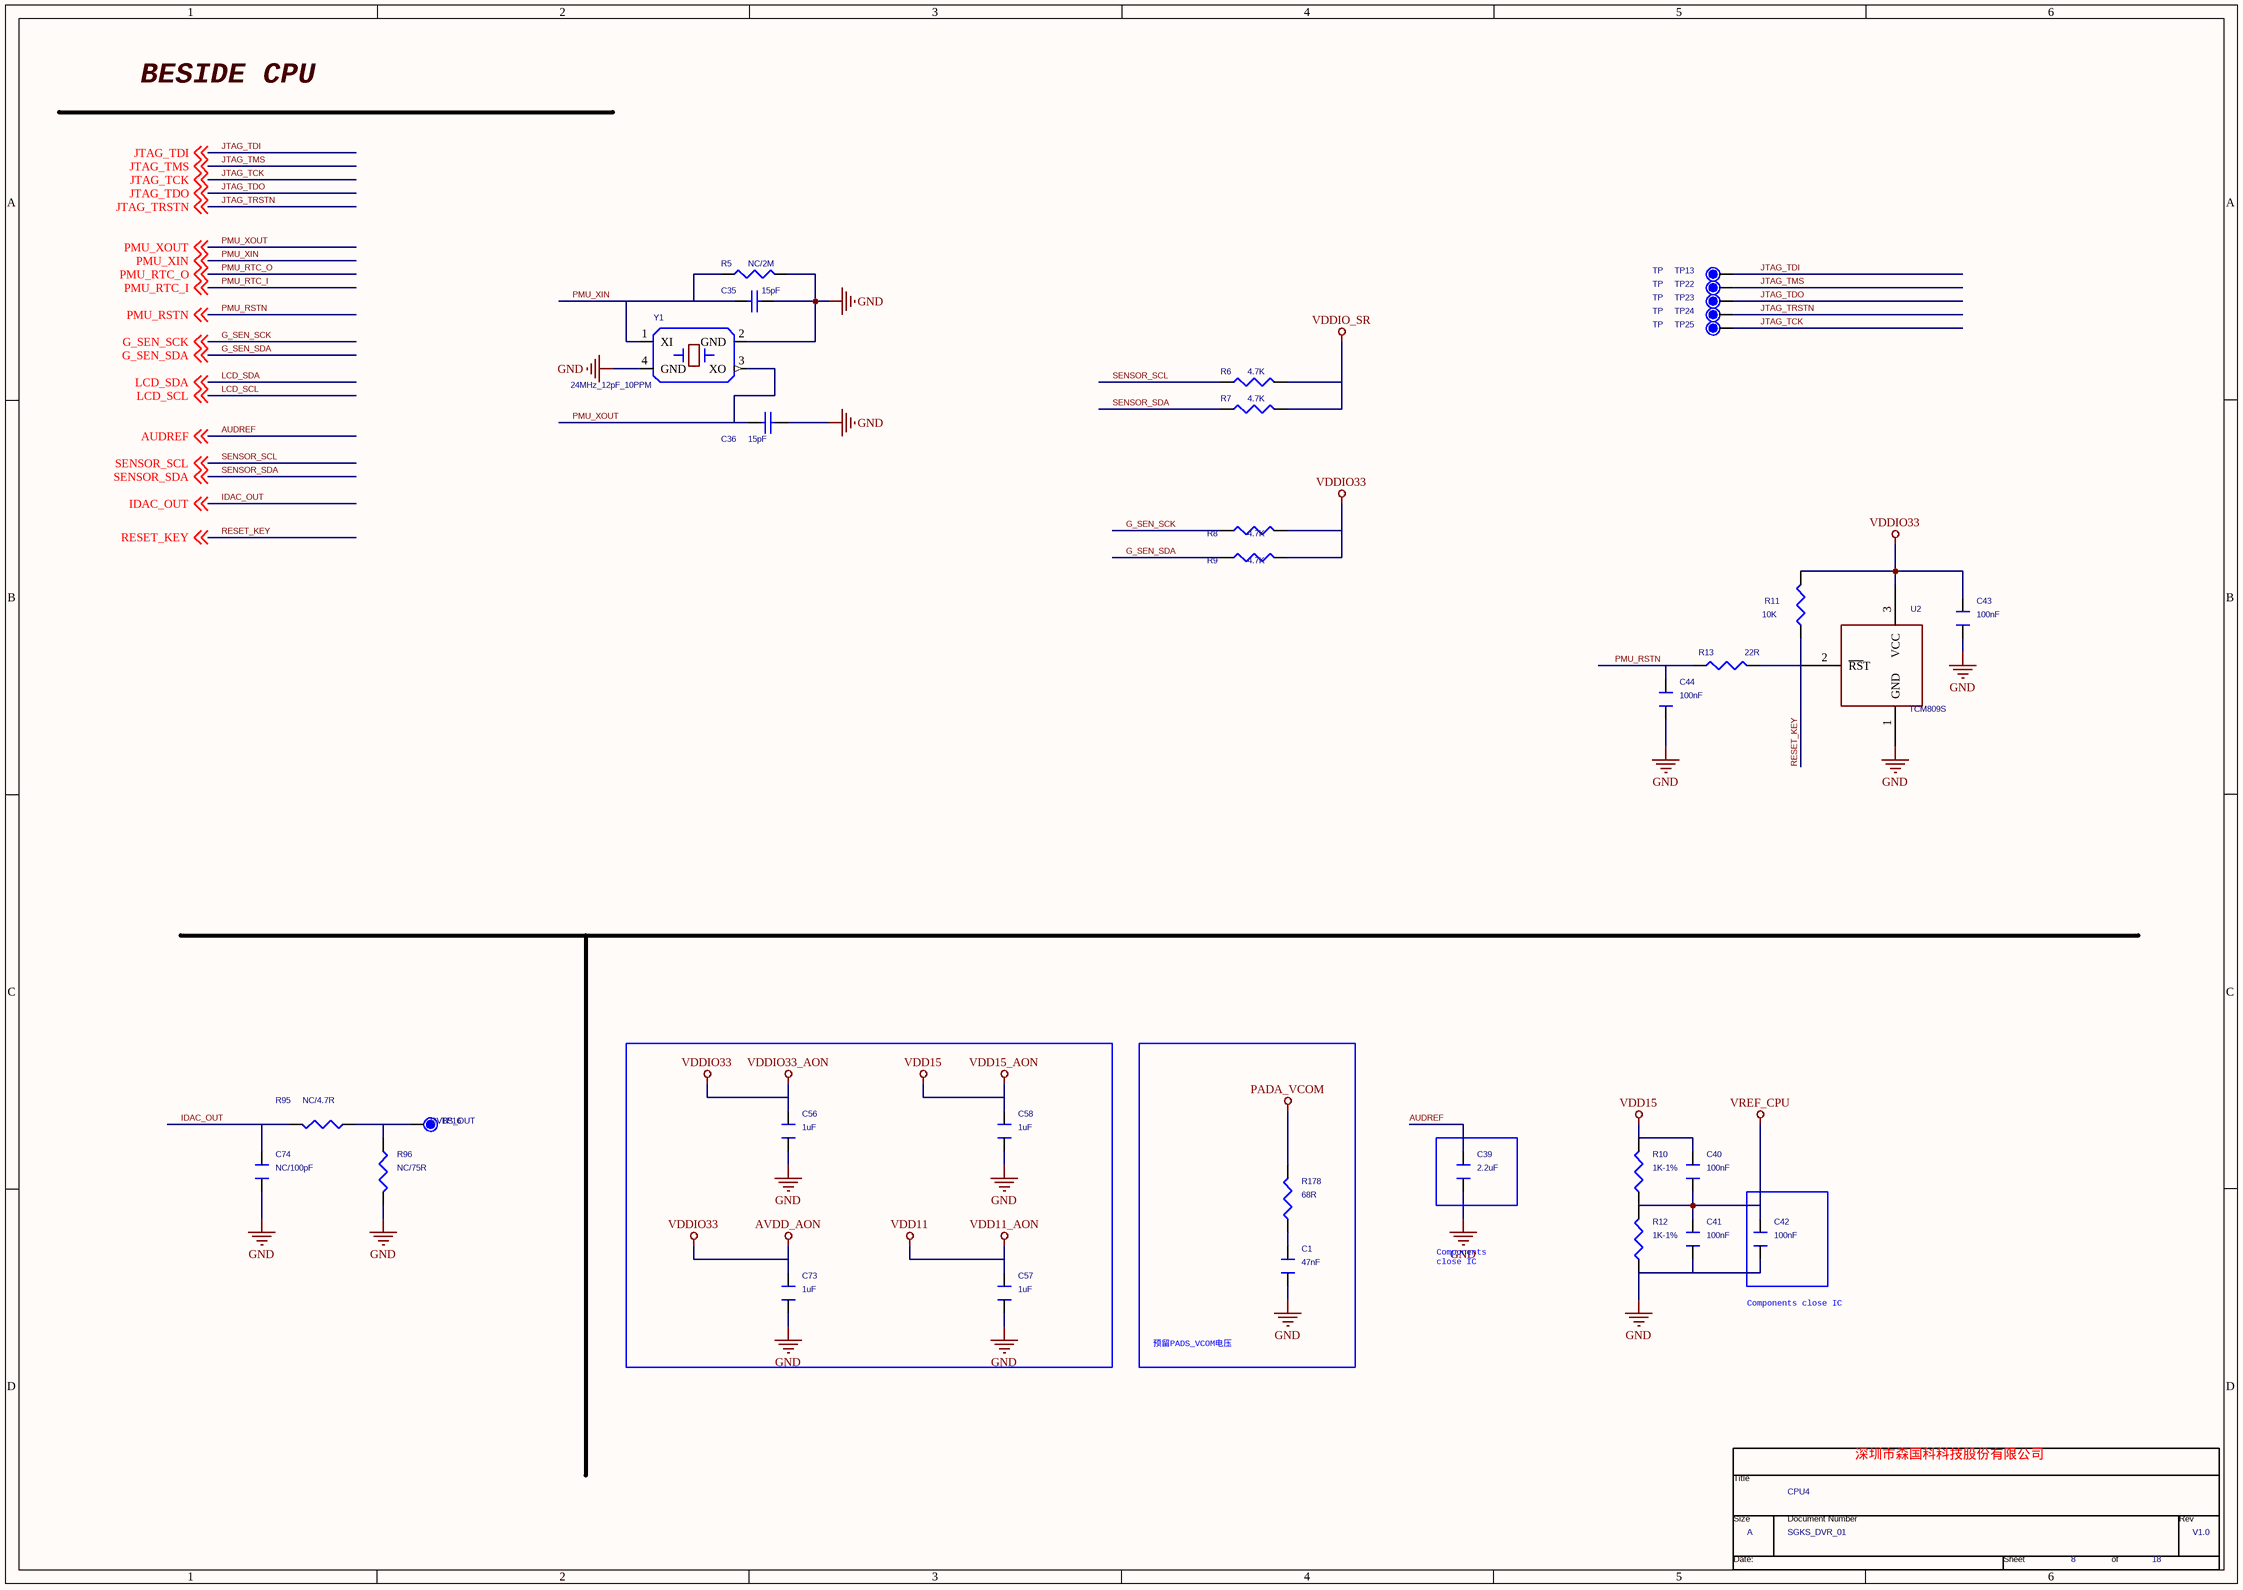
[diagram p9: P08 CPU_4.SchDoc]

### Parts
(Parts that share a designator on the sheet are numbered #1, #2 ... from top to bottom, then left to right.)
*#10  Page Count: 18  Page Number: 8  Page Size: A  Title: CPU4  RevCode: V1.0  Doc: SGKS_DVR_01  (hidden comment: TitleBlock0)  (graphical)
C1  47nF  [C0402]
C35  15pF  [C0402]
C36  15pF  [C0402]
C39  2.2uF  [C0402]
C40  100nF  [C0402]
C41  100nF  [C0402]
C42  100nF  [C0402]
C43  100nF  [C0402]
C44  100nF  [C0402]
C56  1uF  [C0402]
C57  1uF  [C0402]
C58  1uF  [C0402]
C73  1uF  [C0402]
C74  NC/100pF  [C0402]
R5  NC/2M  [R0603/SMD]
R6  4.7K  [R0603/SMD]
R7  4.7K  [R0603/SMD]
R8  4.7K  [R0402]
R9  4.7K  [R0402]
R10  1K-1%  [R0402]
R11  10K  [R0402]
R12  1K-1%  [R0402]
R13  22R  [R0402]
R95  NC/4.7R  [R0402]
R96  NC/75R  [R0402]
R178  68R  [R0402]
TP13  TP  [TP/SMD/D1.0]
TP16  CVBS_OUT  [TP/SMD/D1.0]
TP22  TP  [TP/SMD/D1.0]
TP23  TP  [TP/SMD/D1.0]
TP24  TP  [TP/SMD/D1.0]
TP25  TP  [TP/SMD/D1.0]
U2  TCM809S  [SOT-23]
Y1  24MHz_12pF_10PPM  [OSC4_SMD_50X32]

### Blocks framed on the sheet
预留PADS_VCOM电压: C1 R178

### Nets
AVDD_AON: C43.2 C56.2 C73.2 R8.2 R9.2 R11.1 U2.3(VCC)  [also labelled VDDIO33, VDDIO33_AON]  [project net AVDD33]
GND: C1.1 C35.2 C36.2 C39.2 C41.2 C42.2 C43.1 C44.1 C56.1 C57.1 C58.1 C73.1 C74.2 R5.2 R12.1 R96.2 U2.1(GND) Y1.2(GND) Y1.4(GND)
PADA_VCOM: R178.2
VDD11: C57.2  [also labelled VDD11_AON]
VDD15: C40.1 C58.2 R10.2  [also labelled VDD15_AON]
VDDIO_SR: R6.2 R7.2
VREF_CPU: C40.2 C41.1 C42.1 R10.1 R12.2
AUDREF: C39.1 ; off-sheet AUDREF
G_SEN_SCK: R8.1 ; off-sheet G_SEN_SCK
G_SEN_SDA: R9.1 ; off-sheet G_SEN_SDA
IDAC_OUT: C74.1 R95.2 ; off-sheet IDAC_OUT
JTAG_TCK: TP25.1 ; off-sheet JTAG_TCK
JTAG_TDI: TP13.1 ; off-sheet JTAG_TDI
JTAG_TDO: TP23.1 ; off-sheet JTAG_TDO
JTAG_TMS: TP22.1 ; off-sheet JTAG_TMS
JTAG_TRSTN: TP24.1 ; off-sheet JTAG_TRSTN
PMU_RSTN: C44.2 R13.2 ; off-sheet PMU_RSTN
PMU_XIN: C35.1 R5.1 Y1.1(XI) ; off-sheet PMU_XIN
PMU_XOUT: C36.1 Y1.3(XO) ; off-sheet PMU_XOUT
RESET_KEY: R11.2 R13.1 U2.2(~{RS}T) ; off-sheet RESET_KEY
SENSOR_SCL: R6.1 ; off-sheet SENSOR_SCL
SENSOR_SDA: R7.1 ; off-sheet SENSOR_SDA
NetC1_2: C1.2 R178.1
NetR95_1: R95.1 R96.1 TP16.1

### Notes on the sheet
- BESIDE CPU
- Components
  close IC
- Components close IC
- 深圳市森国科科技股份有限公司
- (in symbol TitleBlock0) Title; Size; Document Number; Rev; Date:; Sheet; of

### Library data of the parts
C1 C43 C44 C56-C58 C73 = CAPACITOR: PAGE: 1
C35 C36 = CAP/CB_0: Part Description: Chip Capacitor
C39-C42 C74 = CAPACITOR_0_Dup3
R5 = RES/SMD_0: Part Description: Chip Resistor
R6 R7 = RES/SMD_1: Part Description: Chip Resistor; Type: 贴片电阻
R8 R9 = ?_0: as R83 on sheet P14 FLASH & TF & GSENSO; Vendor: R0402
R10 R178 = RESISTOR_Dup1: as R46 on sheet P09 DDR3
R11 R13 = RESISTOR_Dup2
R12 R95 R96 = RESISTOR_Dup1: as R47 on sheet P09 DDR3
TP13 TP16 TP22-TP25 = TP_0: Part Description: Test Point; Type: NC
Y1 = CRYSTAL/4P: Type: 贴片晶振?
*#10 = TitleBlock0: Page Create Date: March  8, 1995

## Sheet P07 CPU_3.SchDoc
size 386 x 246 mm
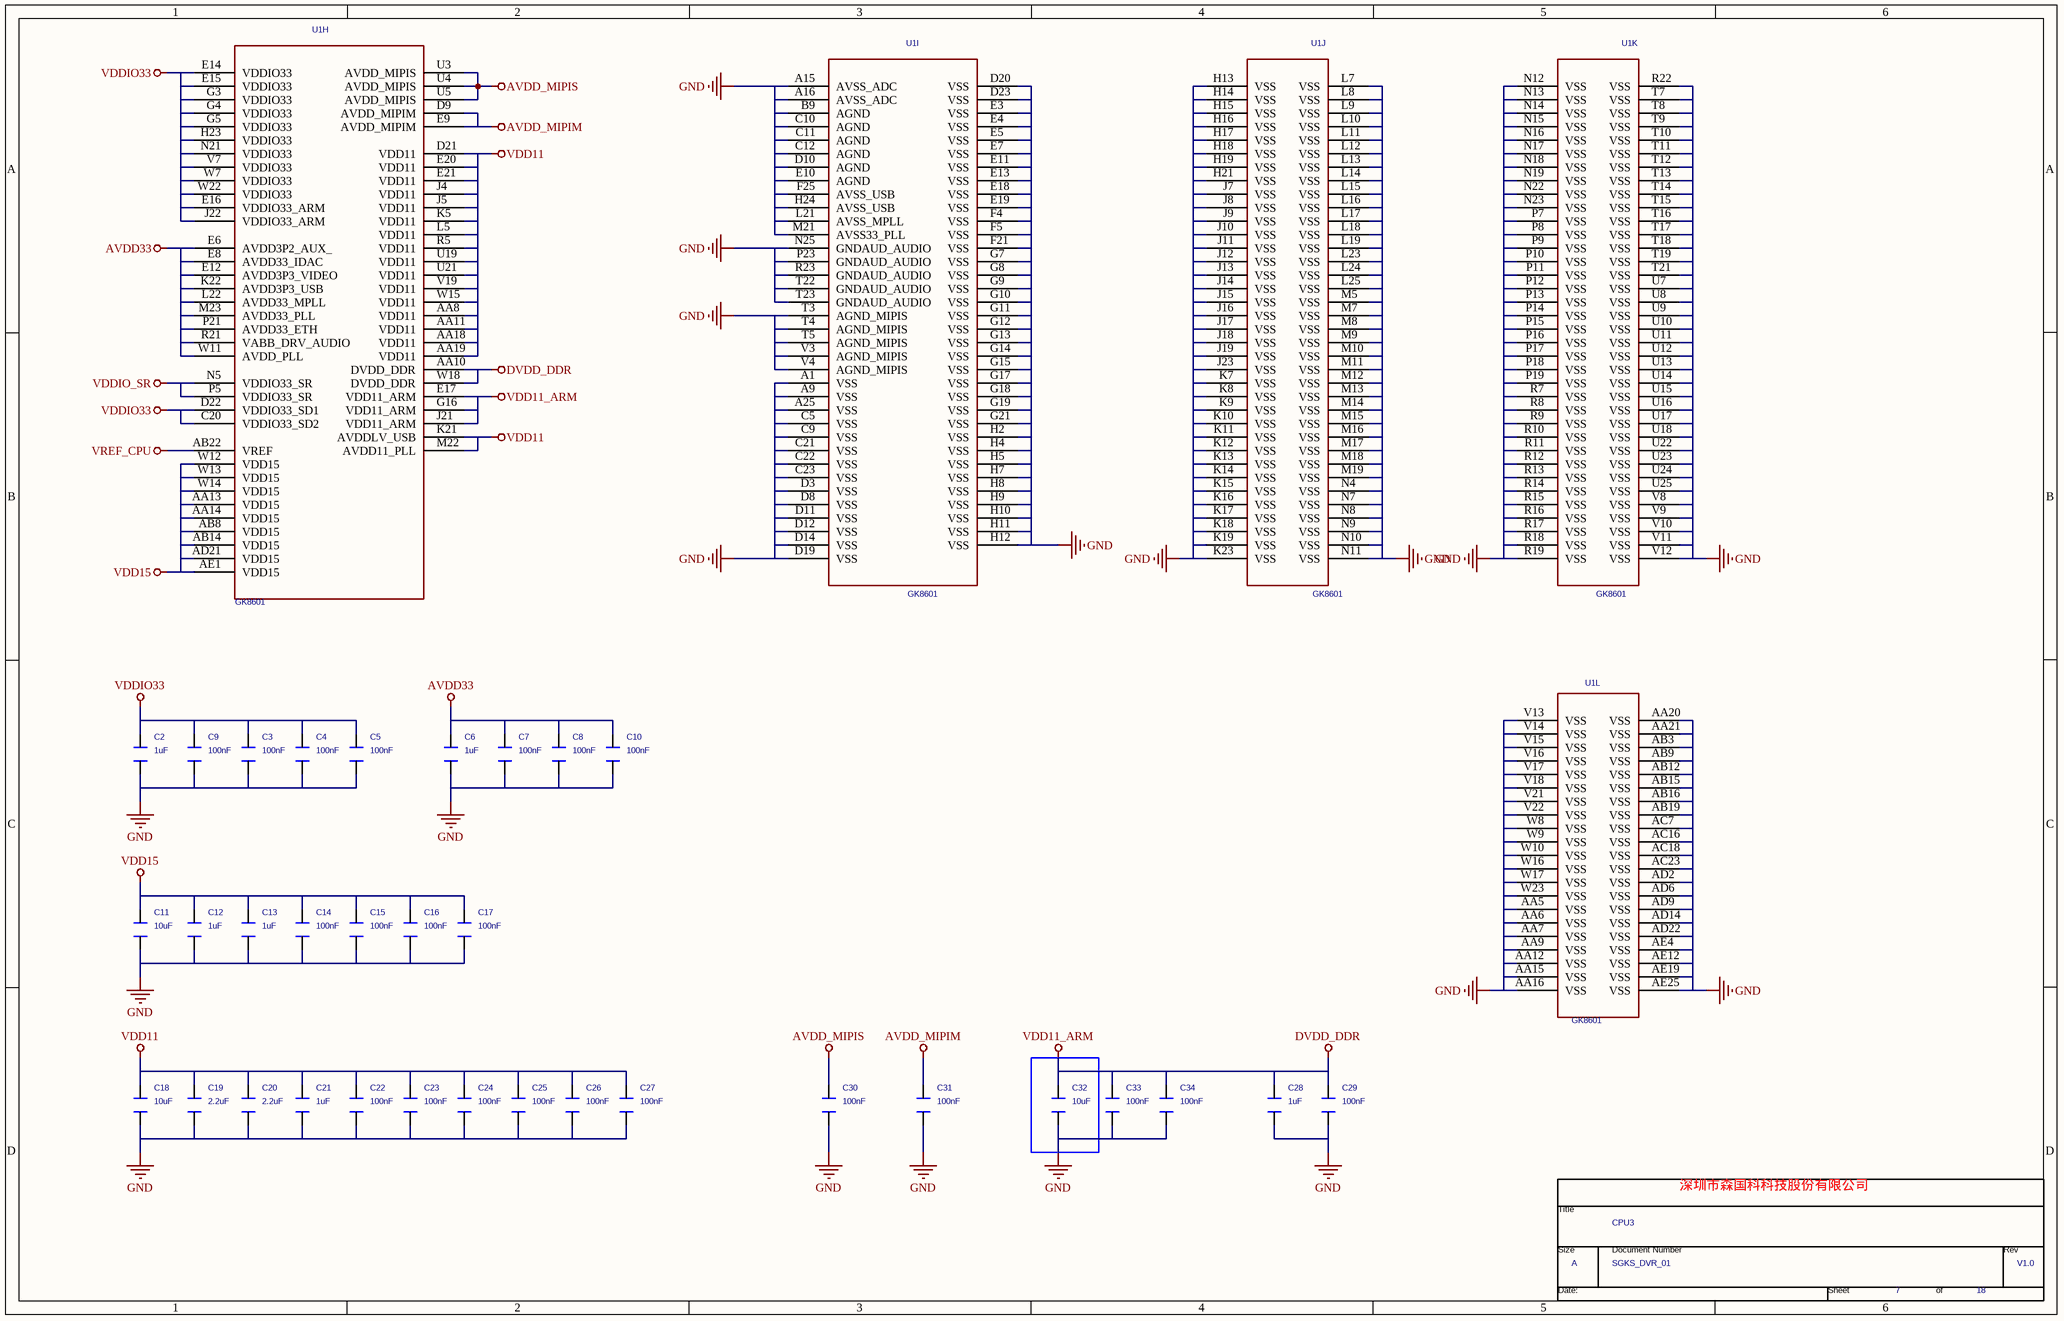
[diagram p10: P07 CPU_3.SchDoc]

### Parts
(Parts that share a designator on the sheet are numbered #1, #2 ... from top to bottom, then left to right.)
*#11  Page Count: 18  Page Number: 7  Page Size: A  Title: CPU3  RevCode: V1.0  Doc: SGKS_DVR_01  (hidden comment: TitleBlock0)  (graphical)
C2  1uF  [C0402]
C3  100nF  [C0402]
C4  100nF  [C0402]
C5  100nF  [C0402]
C6  1uF  [C0402]
C7  100nF  [C0402]
C8  100nF  [C0402]
C9  100nF  [C0402]
C10  100nF  [C0402]
C11  10uF  [C0603]
C12  1uF  [C0402]
C13  1uF  [C0402]
C14  100nF  [C0402]
C15  100nF  [C0402]
C16  100nF  [C0402]
C17  100nF  [C0402]
C18  10uF  [C0603]
C19  2.2uF  [C0402]
C20  2.2uF  [C0402]
C21  1uF  [C0402]
C22  100nF  [C0402]
C23  100nF  [C0402]
C24  100nF  [C0402]
C25  100nF  [C0402]
C26  100nF  [C0402]
C27  100nF  [C0402]
C28  1uF  [C0402]
C29  100nF  [C0402]
C30  100nF  [C0402]
C31  100nF  [C0402]
C32  10uF  [C0603]
C33  100nF  [C0402]
C34  100nF  [C0402]
U1  GK8601  [FBGA-569-0.65-17X17]  (parts H,I,J,K,L of 12)

### Nets
AVDD33: C2.2 C3.2 C4.2 C5.2 C6.2 C7.2 C8.2 C9.2 C10.2 U1.C20(VDDIO33_SD2) U1.D22(VDDIO33_SD1) U1.E6(AVDD3P2_AUX_) U1.E8(AVDD33_IDAC) U1.E12(AVDD3P3_VIDEO) U1.E14(VDDIO33) U1.E15(VDDIO33) U1.E16(VDDIO33_ARM) U1.G3(VDDIO33) U1.G4(VDDIO33) U1.G5(VDDIO33) U1.H23(VDDIO33) U1.J22(VDDIO33_ARM) U1.K22(AVDD3P3_USB) U1.L22(AVDD33_MPLL) U1.M23(AVDD33_PLL) U1.N21(VDDIO33) U1.P21(AVDD33_ETH) U1.R21(VABB_DRV_AUDIO) U1.V7(VDDIO33) U1.W7(VDDIO33) U1.W11(AVDD_PLL) U1.W22(VDDIO33)  [also labelled VDDIO33]
AVDD_MIPIM: C30.2 C31.2 U1.D9(AVDD_MIPIM) U1.E9(AVDD_MIPIM) U1.U3(AVDD_MIPIS) U1.U4(AVDD_MIPIS) U1.U5(AVDD_MIPIS)  [also labelled AVDD_MIPIS]
DVDD_DDR: C28.2 C29.2 C32.2 C33.2 C34.2 U1.AA10(DVDD_DDR) U1.E17(VDD11_ARM) U1.G16(VDD11_ARM) U1.J21(VDD11_ARM) U1.W18(DVDD_DDR)  [also labelled VDD11_ARM]
GND: C2.1 C3.1 C4.1 C5.1 C6.1 C7.1 C8.1 C9.1 C10.1 C11.1 C12.1 C13.1 C14.1 C15.1 C16.1 C17.1 C18.1 C19.1 C20.1 C21.1 C22.1 C23.1 C24.1 C25.1 C26.1 C27.1 C28.1 C29.1 C30.1 C31.1 C32.1 C33.1 C34.1 U1.A1(VSS) U1.A9(VSS) U1.A15(AVSS_ADC) U1.A16(AVSS_ADC) U1.A25(VSS) U1.AA5(VSS) U1.AA6(VSS) U1.AA7(VSS) U1.AA9(VSS) U1.AA12(VSS) U1.AA15(VSS) U1.AA16(VSS) U1.AA20(VSS) U1.AA21(VSS) U1.AB3(VSS) U1.AB9(VSS) U1.AB12(VSS) U1.AB15(VSS) U1.AB16(VSS) U1.AB19(VSS) U1.AC7(VSS) U1.AC16(VSS) U1.AC18(VSS) U1.AC23(VSS) U1.AD2(VSS) U1.AD6(VSS) U1.AD9(VSS) U1.AD14(VSS) U1.AD22(VSS) U1.AE4(VSS) U1.AE12(VSS) U1.AE19(VSS) U1.AE25(VSS) U1.B9(AGND) U1.C5(VSS) U1.C9(VSS) U1.C10(AGND) U1.C11(AGND) U1.C12(AGND) U1.C21(VSS) U1.C22(VSS) U1.C23(VSS) U1.D3(VSS) U1.D8(VSS) U1.D10(AGND) U1.D11(VSS) U1.D12(VSS) U1.D14(VSS) U1.D19(VSS) U1.D20(VSS) U1.D23(VSS) U1.E3(VSS) U1.E4(VSS) U1.E5(VSS) U1.E7(VSS) U1.E10(AGND) U1.E11(VSS) U1.E13(VSS) U1.E18(VSS) U1.E19(VSS) U1.F4(VSS) U1.F5(VSS) U1.F21(VSS) U1.F25(AVSS_USB) U1.G7(VSS) U1.G8(VSS) U1.G9(VSS) U1.G10(VSS) U1.G11(VSS) U1.G12(VSS) U1.G13(VSS) U1.G14(VSS) U1.G15(VSS) U1.G17(VSS) U1.G18(VSS) U1.G19(VSS) U1.G21(VSS) U1.H2(VSS) U1.H4(VSS) U1.H5(VSS) U1.H7(VSS) U1.H8(VSS) U1.H9(VSS) U1.H10(VSS) U1.H11(VSS) U1.H12(VSS) U1.H13(VSS) U1.H14(VSS) U1.H15(VSS) U1.H16(VSS) U1.H17(VSS) U1.H18(VSS) U1.H19(VSS) U1.H21(VSS) U1.H24(AVSS_USB) U1.J7(VSS) U1.J8(VSS) U1.J9(VSS) U1.J10(VSS) U1.J11(VSS) U1.J12(VSS) U1.J13(VSS) U1.J14(VSS) U1.J15(VSS) U1.J16(VSS) U1.J17(VSS) U1.J18(VSS) U1.J19(VSS) U1.J23(VSS) U1.K7(VSS) U1.K8(VSS) U1.K9(VSS) U1.K10(VSS) U1.K11(VSS) U1.K12(VSS) U1.K13(VSS) U1.K14(VSS) U1.K15(VSS) U1.K16(VSS) U1.K17(VSS) U1.K18(VSS) U1.K19(VSS) U1.K23(VSS) U1.L7(VSS) U1.L8(VSS) U1.L9(VSS) U1.L10(VSS) U1.L11(VSS) U1.L12(VSS) U1.L13(VSS) U1.L14(VSS) U1.L15(VSS) U1.L16(VSS) U1.L17(VSS) U1.L18(VSS) U1.L19(VSS) U1.L21(AVSS_MPLL) U1.L23(VSS) U1.L24(VSS) U1.L25(VSS) U1.M5(VSS) U1.M7(VSS) U1.M8(VSS) U1.M9(VSS) U1.M10(VSS) U1.M11(VSS) U1.M12(VSS) U1.M13(VSS) U1.M14(VSS) U1.M15(VSS) U1.M16(VSS) U1.M17(VSS) U1.M18(VSS) U1.M19(VSS) U1.M21(AVSS33_PLL) U1.N4(VSS) U1.N7(VSS) U1.N8(VSS) U1.N9(VSS) U1.N10(VSS) U1.N11(VSS) U1.N12(VSS) U1.N13(VSS) U1.N14(VSS) U1.N15(VSS) U1.N16(VSS) U1.N17(VSS) U1.N18(VSS) U1.N19(VSS) U1.N22(VSS) U1.N23(VSS) U1.N25(GNDAUD_AUDIO) U1.P7(VSS) U1.P8(VSS) U1.P9(VSS) U1.P10(VSS) U1.P11(VSS) U1.P12(VSS) U1.P13(VSS) U1.P14(VSS) U1.P15(VSS) U1.P16(VSS) U1.P17(VSS) U1.P18(VSS) U1.P19(VSS) U1.P23(GNDAUD_AUDIO) U1.R7(VSS) U1.R8(VSS) U1.R9(VSS) U1.R10(VSS) U1.R11(VSS) U1.R12(VSS) U1.R13(VSS) U1.R14(VSS) U1.R15(VSS) U1.R16(VSS) U1.R17(VSS) U1.R18(VSS) U1.R19(VSS) U1.R22(VSS) U1.R23(GNDAUD_AUDIO) U1.T3(AGND_MIPIS) U1.T4(AGND_MIPIS) U1.T5(AGND_MIPIS) U1.T7(VSS) U1.T8(VSS) U1.T9(VSS) U1.T10(VSS) U1.T11(VSS) U1.T12(VSS) U1.T13(VSS) U1.T14(VSS) U1.T15(VSS) U1.T16(VSS) U1.T17(VSS) U1.T18(VSS) U1.T19(VSS) U1.T21(VSS) U1.T22(GNDAUD_AUDIO) U1.T23(GNDAUD_AUDIO) U1.U7(VSS) U1.U8(VSS) U1.U9(VSS) U1.U10(VSS) U1.U11(VSS) U1.U12(VSS) U1.U13(VSS) U1.U14(VSS) U1.U15(VSS) U1.U16(VSS) U1.U17(VSS) U1.U18(VSS) U1.U22(VSS) U1.U23(VSS) U1.U24(VSS) U1.U25(VSS) U1.V3(AGND_MIPIS) U1.V4(AGND_MIPIS) U1.V8(VSS) U1.V9(VSS) U1.V10(VSS) U1.V11(VSS) U1.V12(VSS) U1.V13(VSS) U1.V14(VSS) U1.V15(VSS) U1.V16(VSS) U1.V17(VSS) U1.V18(VSS) U1.V21(VSS) U1.V22(VSS) U1.W8(VSS) U1.W9(VSS) U1.W10(VSS) U1.W16(VSS) U1.W17(VSS) U1.W23(VSS)
VDD11: C18.2 C19.2 C20.2 C21.2 C22.2 C23.2 C24.2 C25.2 C26.2 C27.2 U1.AA8(VDD11) U1.AA11(VDD11) U1.AA18(VDD11) U1.AA19(VDD11) U1.D21(VDD11) U1.E20(VDD11) U1.E21(VDD11) U1.J4(VDD11) U1.J5(VDD11) U1.K5(VDD11) U1.K21(AVDDLV_USB) U1.L5(VDD11) U1.M22(AVDD11_PLL) U1.R5(VDD11) U1.U19(VDD11) U1.U21(VDD11) U1.V19(VDD11) U1.W15(VDD11)
VDD15: C11.2 C12.2 C13.2 C14.2 C15.2 C16.2 C17.2 U1.AA13(VDD15) U1.AA14(VDD15) U1.AB8(VDD15) U1.AB14(VDD15) U1.AD21(VDD15) U1.AE1(VDD15) U1.W12(VDD15) U1.W13(VDD15) U1.W14(VDD15)
VDDIO_SR: U1.N5(VDDIO33_SR) U1.P5(VDDIO33_SR)
VREF_CPU: U1.AB22(VREF)

### Notes on the sheet
- 深圳市森国科科技股份有限公司
- (in symbol TitleBlock0) Title; Size; Document Number; Rev; Date:; Sheet; of

### Library data of the parts
C2-C34 = CAPACITOR: PAGE: 1
U1 = GK8601_12
*#11 = TitleBlock0: Page Create Date: March  8, 1995